# EAGLE board evcu_v_0-2 (EAGLE 6.5.0), part 1 of 2
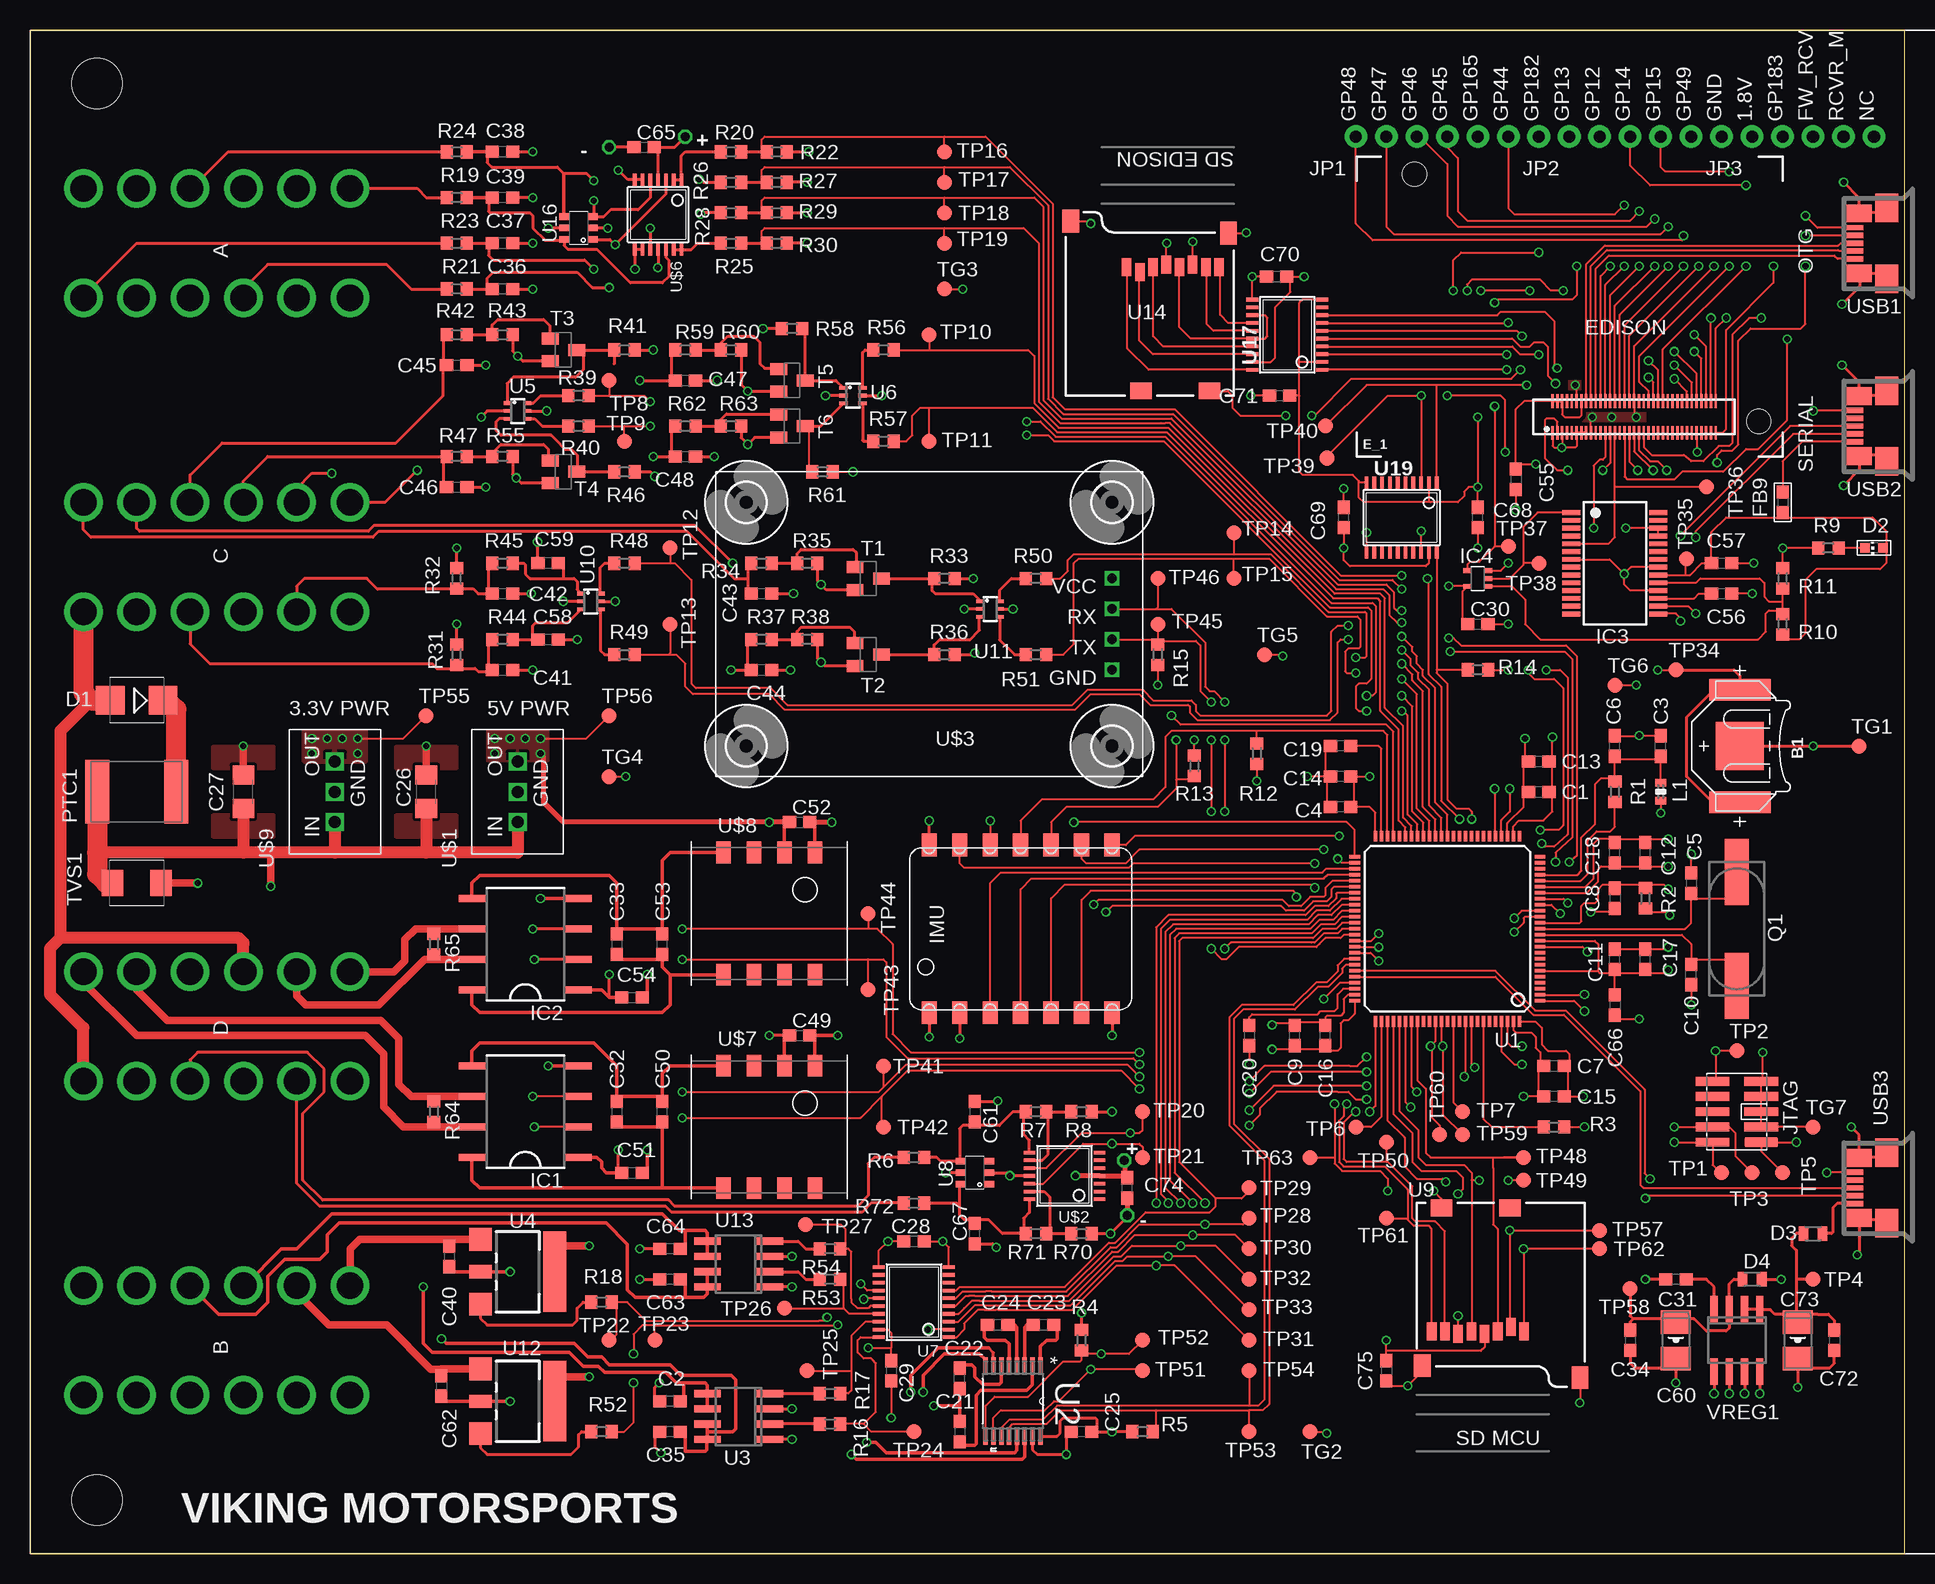
[diagram p9: board, top side]
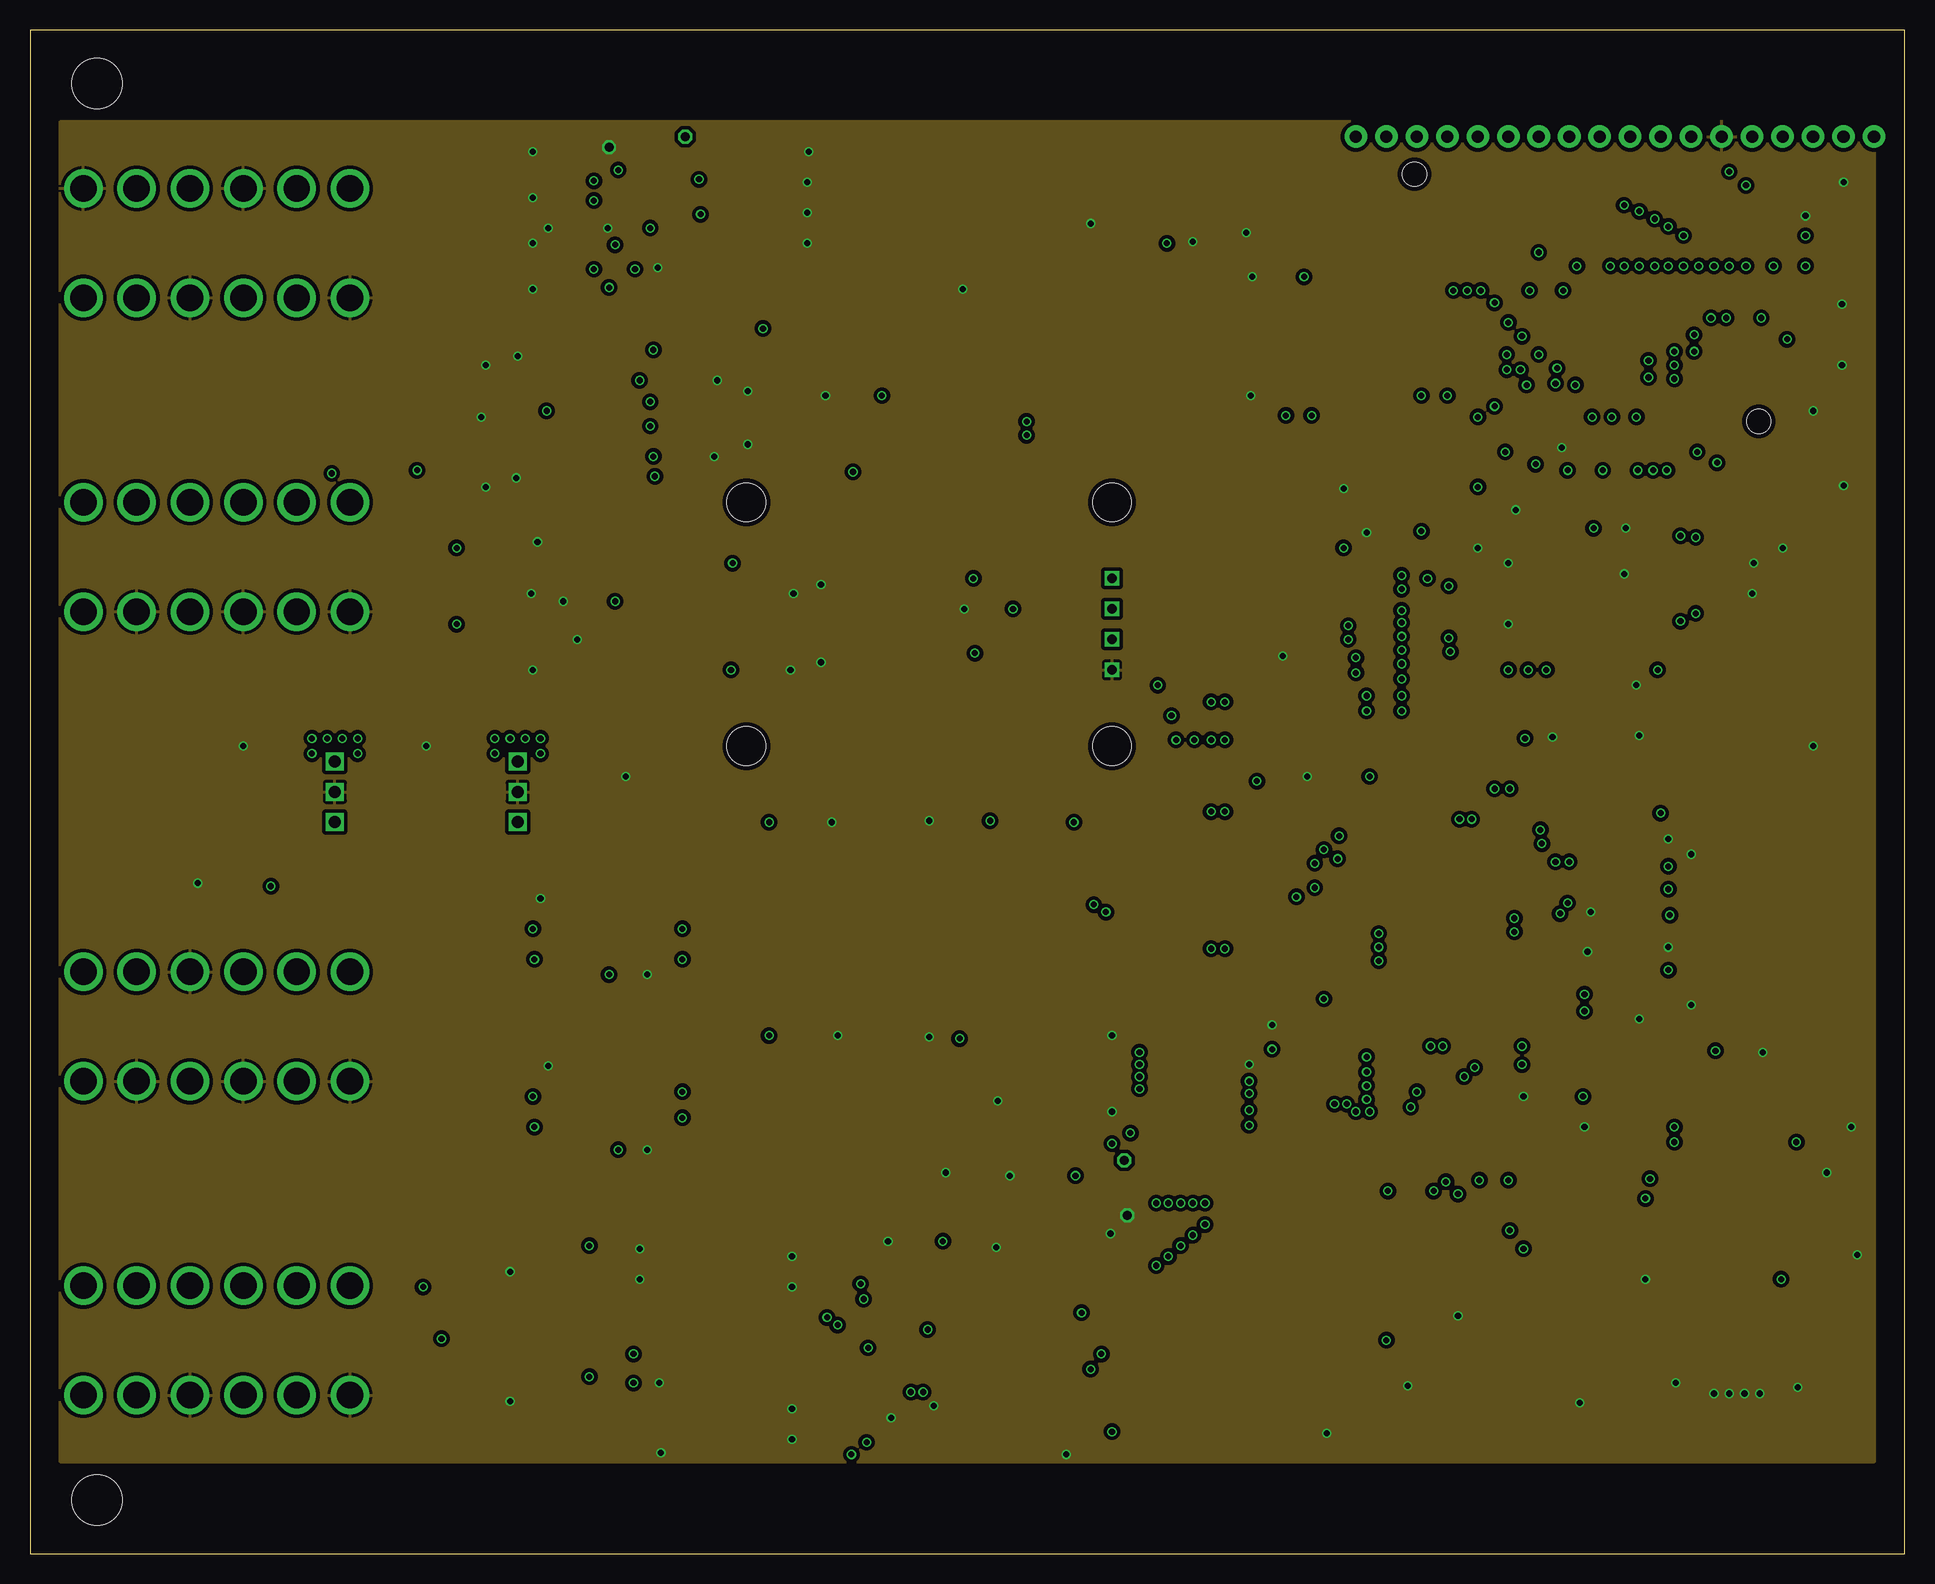
[diagram p10: board, inner layer Ground]
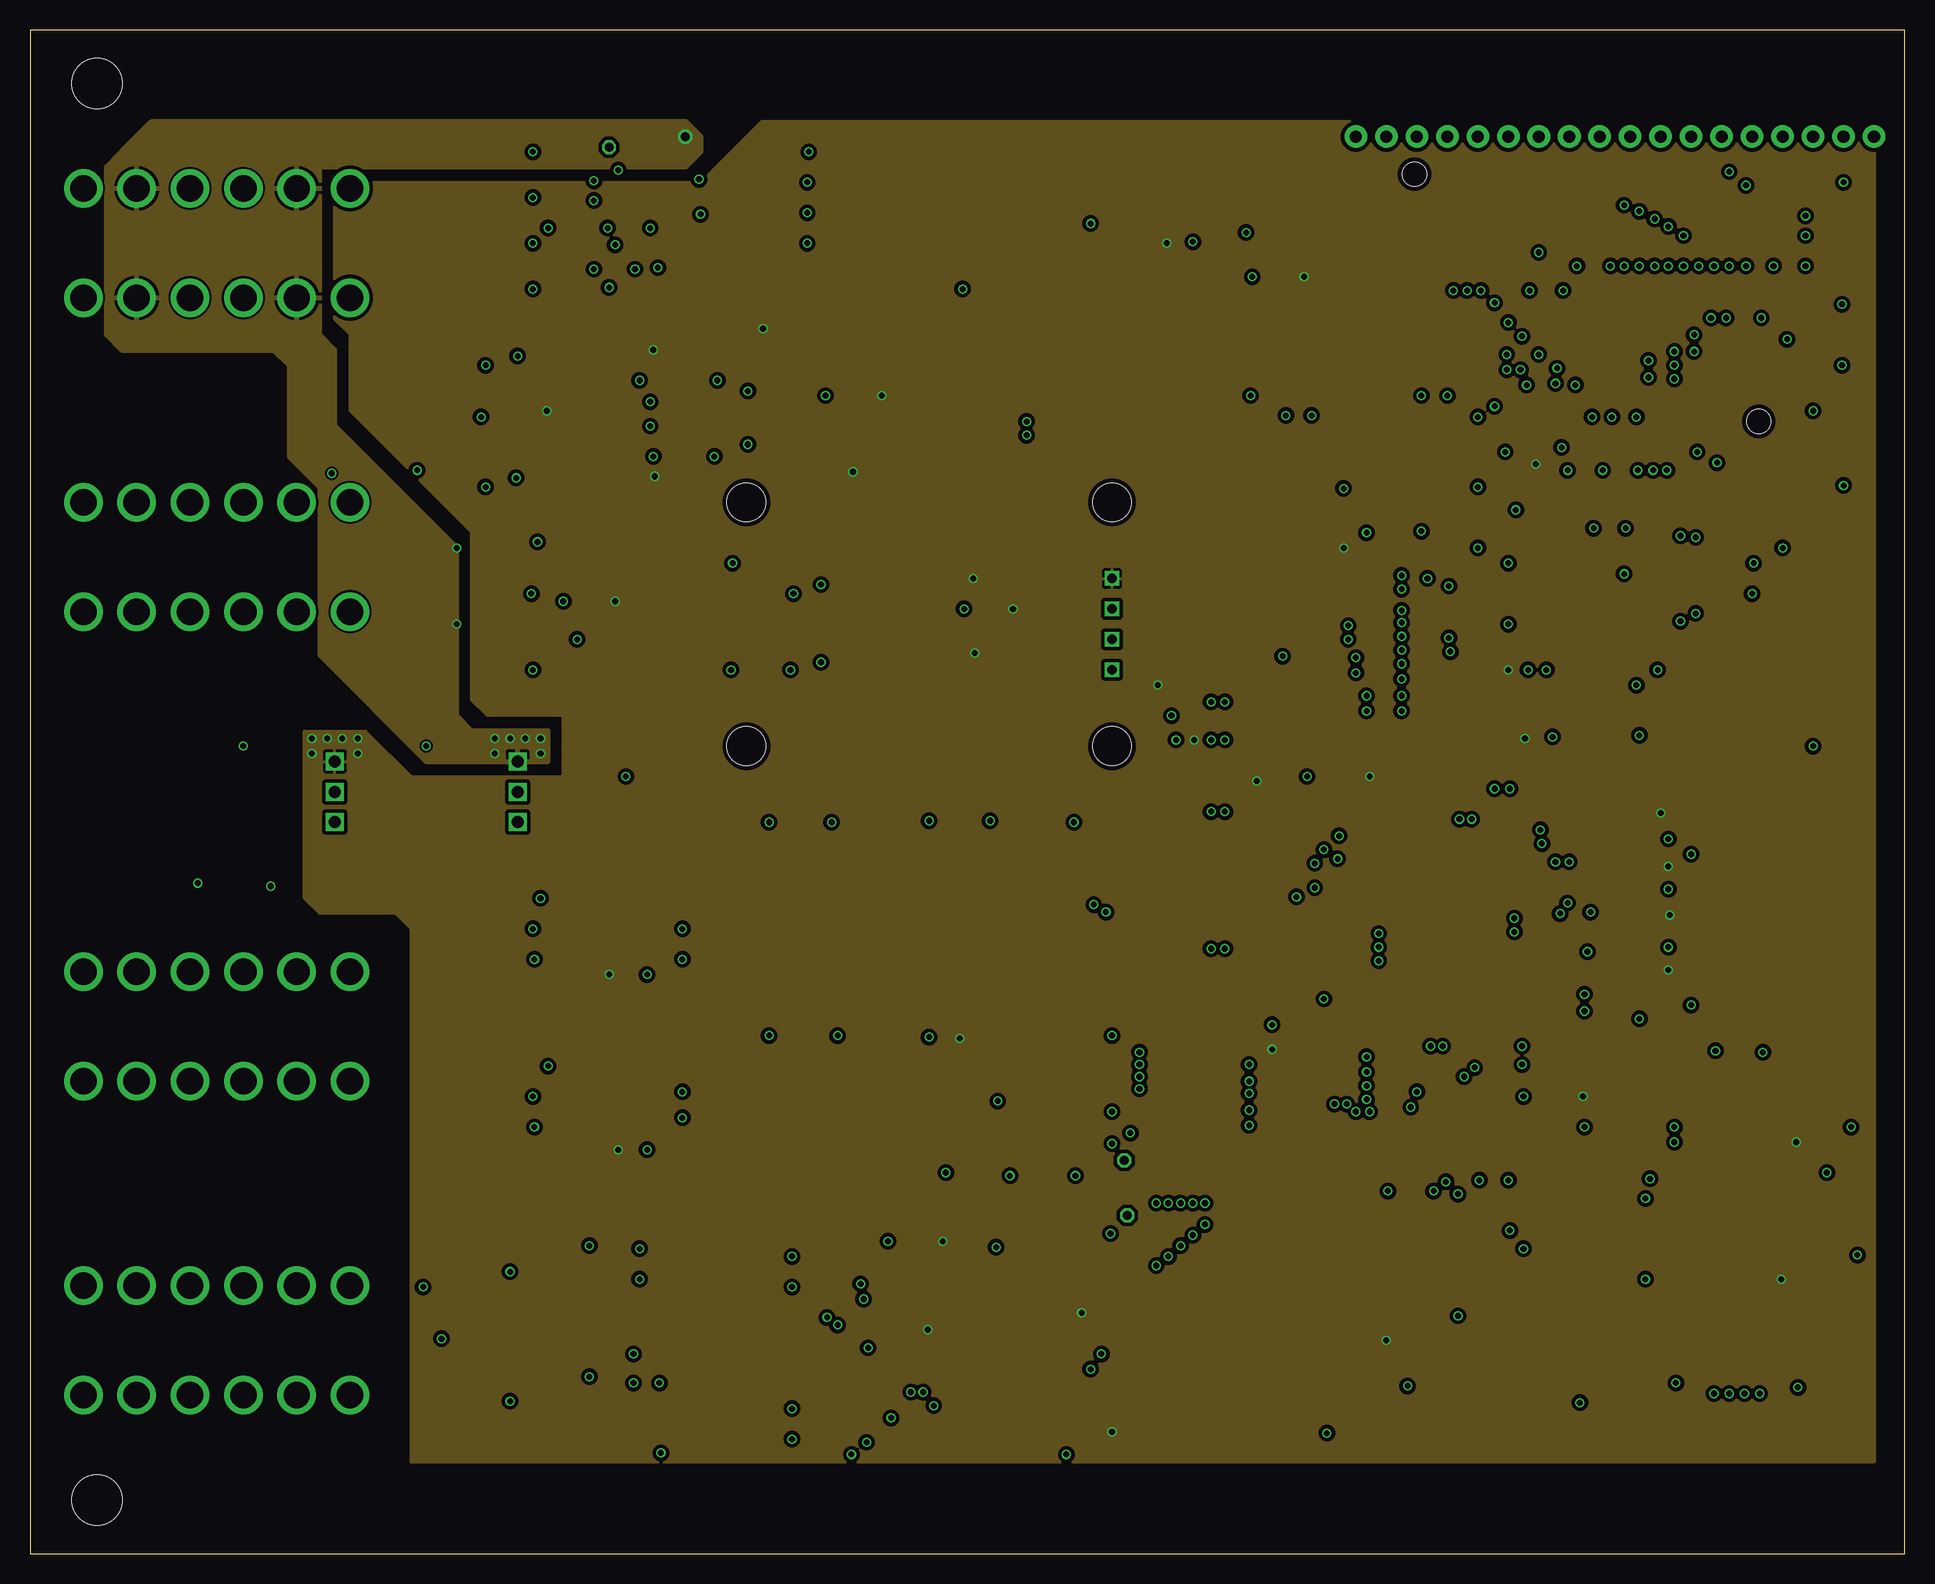
[diagram p11: board, inner layer Power]
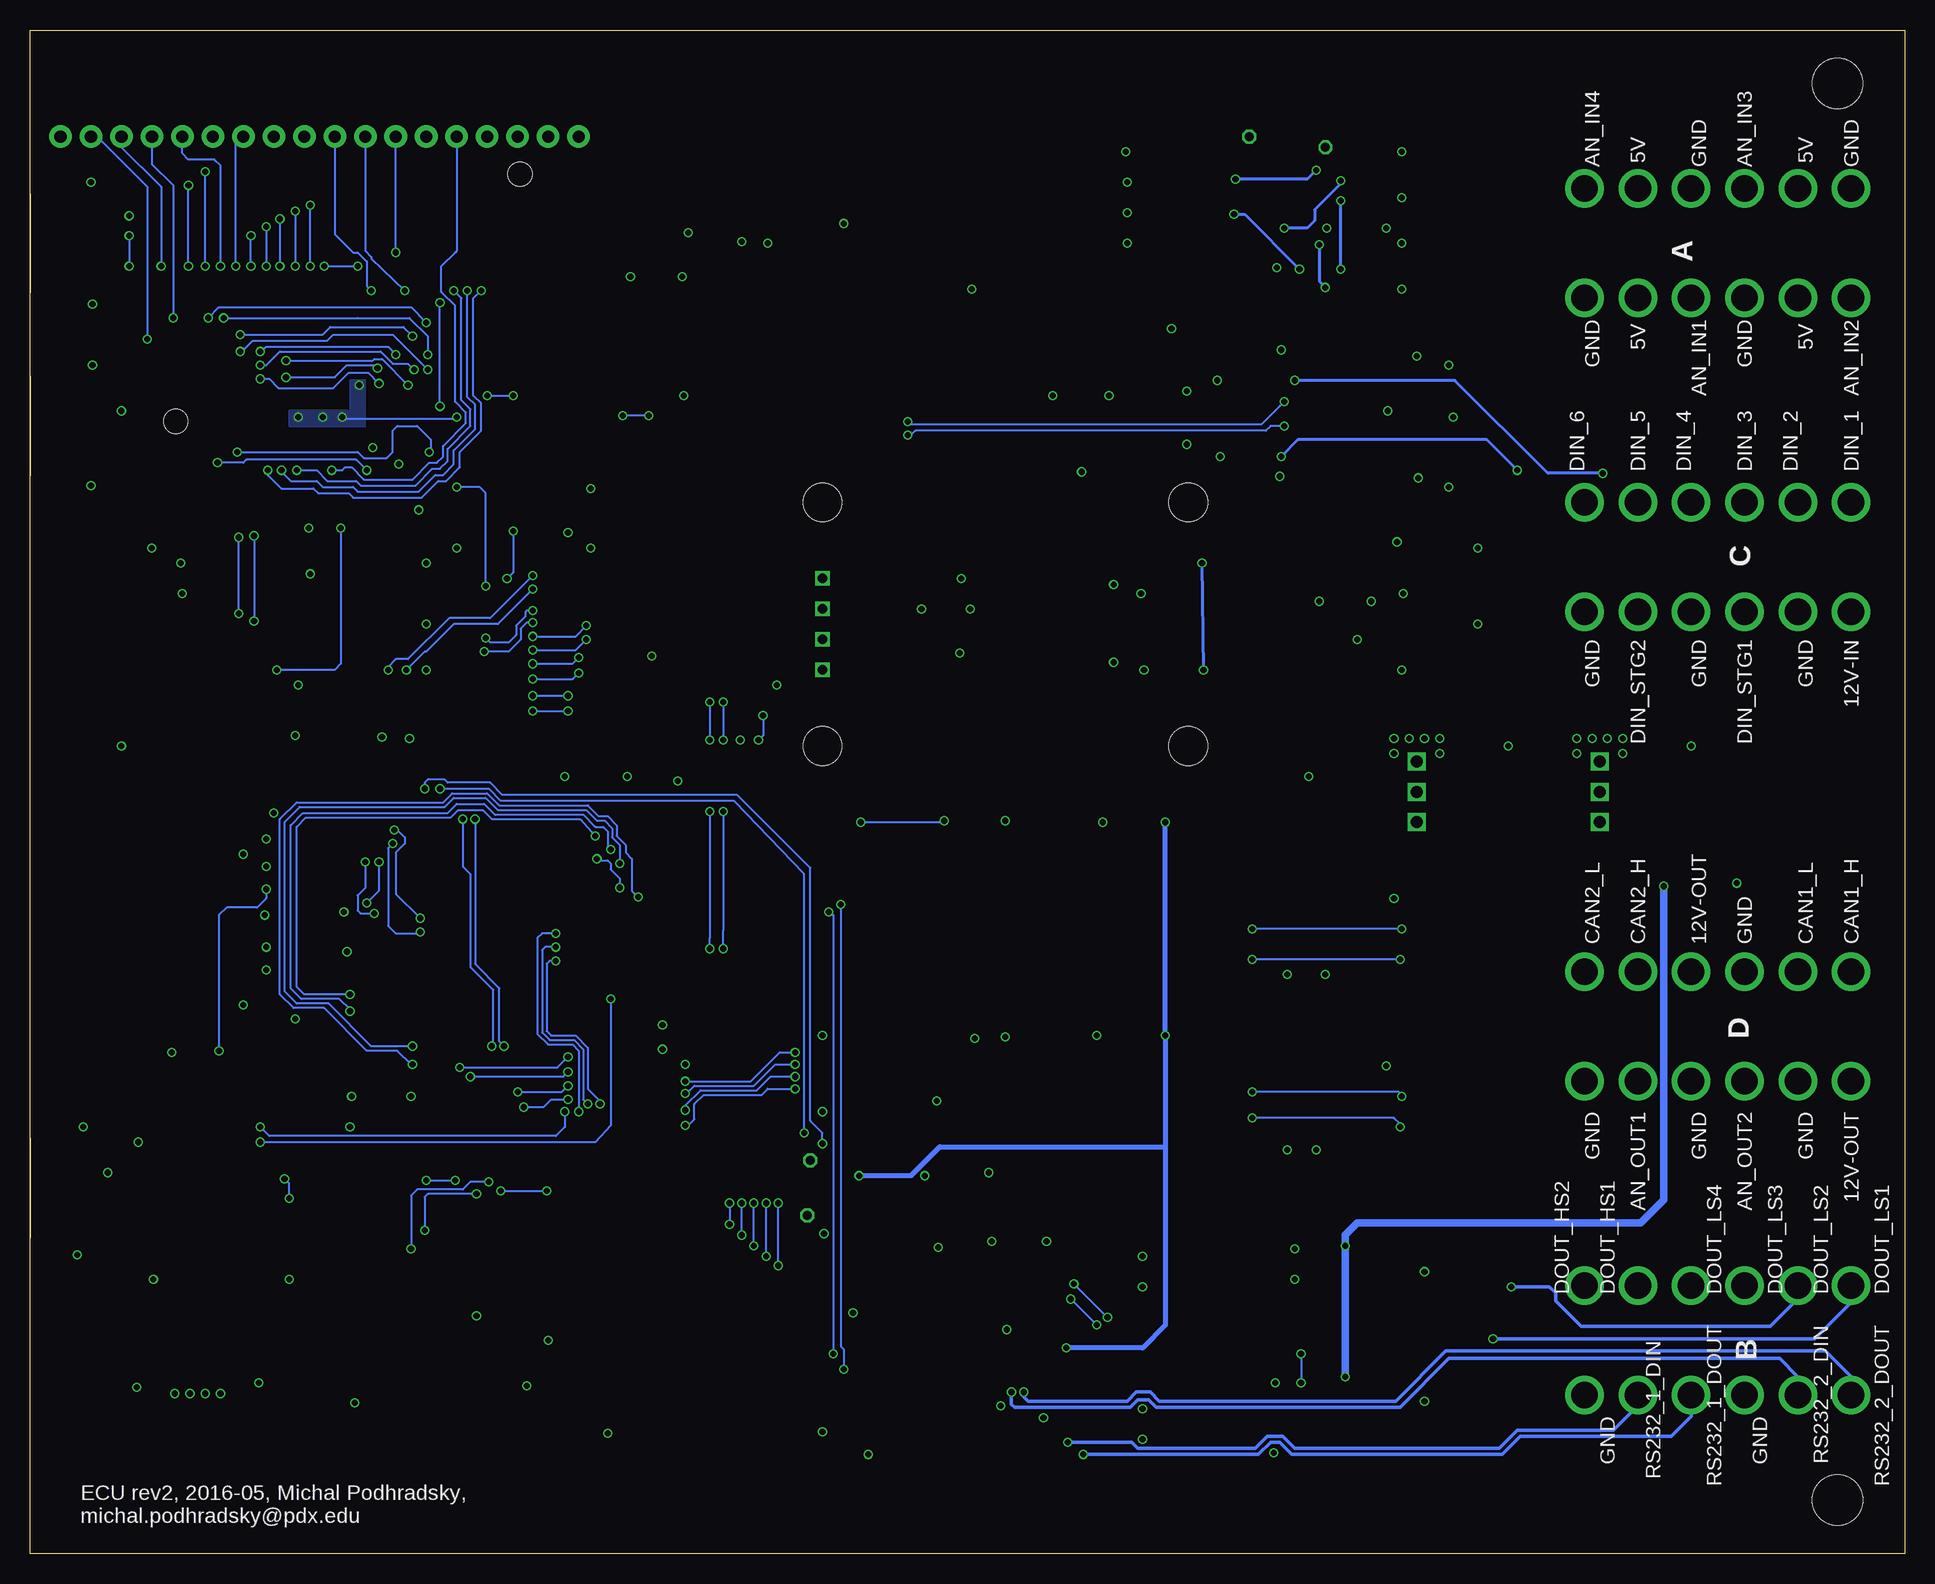
[diagram p12: board, bottom side, seen from below]

Size 156.21 x 127 mm. Coordinates in mm from the lower left corner, seen from the top.
Outline: 0,0 156.21,0 156.21,127 0,127 0,0
Copper layers (1*2*15*16): Top 0.035559375mm / dielectric 0.17018125mm / Ground 0.01778125mm / dielectric 47mil / Power 0.01778125mm / dielectric 0.17018125mm / Bottom 0.035559375mm
Design rules "OSHPark-4layer_edited *": minimum track width 7mil, minimum drill 20mil, track to track 7mil, track to pad 7mil, pad to pad 7mil, via to via 7mil, smd to smd 5mil, copper to edge 15mil, drill to drill 6mil, minimum pad ring 4mil, minimum via ring 4mil, stop-mask expansion 4mil, vias tented up to drill 20mil, thermal gap 10mil
Net classes: 0 default: width 0.178 mm, drill 0.508 mm, clearance 0.178 mm

## Footprints (pad centres in the part's own frame; a part is rotated, then mirrored left to right if it is on the bottom)
BATTERY_6.8MM-2998 = smd 1.8 x 5.1: +1 4.7,0; +2 -4.7,0 | smd 4 x 4: - 0,0
C0603@1 = smd 1.1 x 1: 1 -0.85,0; 2 0.85,0
C1206 = smd 1.6 x 1.8: 1 -1.4,0; 2 1.4,0
C0603 = smd 1.1 x 1: 1 -0.85,0; 2 0.85,0
3528/B = smd 1.95 x 2.5: + -1.525,0; - 1.525,0
SMB = smd 2.4 x 2.4: A 2.2,0; C -2.2,0
D0603 = smd 0.8 x 0.8: A -0.75,0; C 0.75,0
MICROMELF-R = smd 0.8 x 1.2: A 0.8,0; C -0.8,0
EDISON_DAUGHTER = smd 1.14 x 0.2: 1 1.98,19.17; 2 4.62,19.17; 3 1.98,18.77; 4 4.62,18.77; 5 1.98,18.37; 6 4.62,18.37; 7 1.98,17.97; 8 4.62,17.97; 9 1.98,17.57; 10 4.62,17.57; 11 1.98,17.17; 12 4.62,17.17; 13 1.98,16.77; 14 4.62,16.77; 15 1.98,16.37; 16 4.62,16.37; 17 1.98,15.97; 18 4.62,15.97; 19 1.98,15.57; 20 4.62,15.57; 21 1.98,15.17; 22 4.62,15.17; 23 1.98,14.77; 24 4.62,14.77; 25 1.98,14.37; 26 4.62,14.37; 27 1.98,13.97; 28 4.62,13.97; 29 1.98,13.57; 30 4.62,13.57; 31 1.98,13.17; 32 4.62,13.17; 33 1.98,12.77; 34 4.62,12.77; 35 1.98,12.37; 36 4.62,12.37; 37 1.98,11.97; 38 4.62,11.97; 39 1.98,11.57; 40 4.62,11.57; 41 1.98,11.17; 42 4.62,11.17; 43 1.98,10.77; 44 4.62,10.77; 45 1.98,10.37; 46 4.62,10.37; 47 1.98,9.97; 48 4.62,9.97; 49 1.98,9.57; 50 4.62,9.57; 51 1.98,9.17; 52 4.62,9.17; 53 1.98,8.77; 54 4.62,8.77; 55 1.98,8.37; 56 4.62,8.37; 57 1.98,7.97; 58 4.62,7.97; 59 1.98,7.57; 60 4.62,7.57; 61 1.98,7.17; 62 4.62,7.17; 63 1.98,6.77; 64 4.62,6.77; 65 1.98,6.37; 66 4.62,6.37; 67 1.98,5.97; 68 4.62,5.97; 69 1.98,5.57; 70 4.62,5.57 | hole 2: 23.53,30.67; 2.93,1.98
DUB-R-PDSO-G8 = smd 0.6 x 2.2: 1 -3.81,-4.445; 2 -1.27,-4.445; 3 1.27,-4.445; 4 3.81,-4.445; 5 3.81,4.445; 6 1.27,4.445; 7 -1.27,4.445; 8 -3.81,4.445
SSOP28 = smd 0.4 x 1.5: 1 -4.225,-3.625; 2 -3.575,-3.625; 3 -2.925,-3.625; 4 -2.275,-3.625; 5 -1.625,-3.625; 6 -0.975,-3.625; 7 -0.325,-3.625; 8 0.325,-3.625; 9 0.975,-3.625; 10 1.625,-3.625; 11 2.275,-3.625; 12 2.925,-3.625; 13 3.575,-3.625; 14 4.225,-3.625; 15 4.225,3.625; 16 3.575,3.625; 17 2.925,3.625; 18 2.275,3.625; 19 1.625,3.625; 20 0.975,3.625; 21 0.325,3.625; 22 -0.325,3.625; 23 -0.975,3.625; 24 -1.625,3.625; 25 -2.275,3.625; 26 -2.925,3.625; 27 -3.575,3.625; 28 -4.225,3.625
SC70-5 = smd 0.4 x 0.7: 1 -0.65,-0.85; 2 0,-0.85; 3 0.65,-0.85; 4 0.65,0.85; 5 -0.65,0.85
ASPIRIN_1 = smd 1.905 x 1.27: P$1 -6.985,7.62; P$2 -6.985,5.08; P$3 -6.985,2.54; P$4 -6.985,0; P$5 -6.985,-2.54; P$6 -6.985,-5.08; P$7 -6.985,-7.62; P$8 6.985,-7.62; P$9 6.985,-5.08; P$10 6.985,-2.54; P$11 6.985,0; P$12 6.985,2.54; P$13 6.985,5.08; P$14 6.985,7.62
1X06 = drill 1.016 pad 1.88: 1 0,0; 2 2.54,0; 3 5.08,0; 4 7.62,0; 5 10.16,0; 6 12.7,0
FTSH-105-DV = smd 0.74 x 2.8: 1 -2.54,-2.03; 2 -2.54,2.03; 3 -1.27,-2.03; 4 -1.27,2.03; 5 0,-2.03; 6 0,2.03; 7 1.27,-2.03; 8 1.27,2.03; 9 2.54,-2.03; 10 2.54,2.03
0603-IND = smd 0.6 x 0.9: P$1 -0.75,0; P$2 0.75,0
2920L = smd 2 x 5.3: P$1 3.3,0; P$2 -3.3,0
CSM-7X-DU = smd 5.5 x 2: 1 -4.75,0; 2 4.75,0
R0603 = smd 1 x 1.1: 1 -0.85,0; 2 0.85,0
SOT23-BEC = smd 1 x 1.4: B -0.95,-1.1; C 0,1.1; E 0.95,-1.1
B1,27 = smd 1.27 x 1.27: TP 0,0
SMBJ = smd 1.78 x 2.16: A 2.04,0; C -2.03,0
LQFP100 = smd 0.9 x 0.3: 1 -7.72,6; 2 -7.72,5.5; 3 -7.72,5; 4 -7.72,4.5; 5 -7.72,4; 6 -7.72,3.5; 7 -7.72,3; 8 -7.72,2.5; 9 -7.72,2; 10 -7.72,1.5; 11 -7.72,1; 12 -7.72,0.5; 13 -7.72,0; 14 -7.72,-0.5; 15 -7.72,-1; 16 -7.72,-1.5; 17 -7.72,-2; 18 -7.72,-2.5; 19 -7.72,-3; 20 -7.72,-3.5; 21 -7.72,-4; 22 -7.72,-4.5; 23 -7.72,-5; 24 -7.72,-5.5; 25 -7.72,-6; 51 7.72,-6; 52 7.72,-5.5; 53 7.72,-5; 54 7.72,-4.5; 55 7.72,-4; 56 7.72,-3.5; 57 7.72,-3; 58 7.72,-2.5; 59 7.72,-2; 60 7.72,-1.5; 61 7.72,-1; 62 7.72,-0.5; 63 7.72,0; 64 7.72,0.5; 65 7.72,1; 66 7.72,1.5; 67 7.72,2; 68 7.72,2.5; 69 7.72,3; 70 7.72,3.5; 71 7.72,4; 72 7.72,4.5; 73 7.72,5; 74 7.72,5.5; 75 7.72,6 | smd 0.3 x 0.9: 26 -6,-7.72; 27 -5.5,-7.72; 28 -5,-7.72; 29 -4.5,-7.72; 30 -4,-7.72; 31 -3.5,-7.72; 32 -3,-7.72; 33 -2.5,-7.72; 34 -2,-7.72; 35 -1.5,-7.72; 36 -1,-7.72; 37 -0.5,-7.72; 38 0,-7.72; 39 0.5,-7.72; 40 1,-7.72; 41 1.5,-7.72; 42 2,-7.72; 43 2.5,-7.72; 44 3,-7.72; 45 3.5,-7.72; 46 4,-7.72; 47 4.5,-7.72; 48 5,-7.72; 49 5.5,-7.72; 50 6,-7.72; 76 6,7.72; 77 5.5,7.72; 78 5,7.72; 79 4.5,7.72; 80 4,7.72; 81 3.5,7.72; 82 3,7.72; 83 2.5,7.72; 84 2,7.72; 85 1.5,7.72; 86 1,7.72; 87 0.5,7.72; 88 0,7.72; 89 -0.5,7.72; 90 -1,7.72; 91 -1.5,7.72; 92 -2,7.72; 93 -2.5,7.72; 94 -3,7.72; 95 -3.5,7.72; 96 -4,7.72; 97 -4.5,7.72; 98 -5,7.72; 99 -5.5,7.72; 100 -6,7.72
SOP65P640X120-16N = smd 1.473 x 0.356: 1 -2.921,2.286; 2 -2.921,1.626; 3 -2.921,0.965; 4 -2.921,0.33; 5 -2.921,-0.33; 6 -2.921,-0.965; 7 -2.921,-1.626; 8 -2.921,-2.286; 9 2.921,-2.286; 10 2.921,-1.626; 11 2.921,-0.965; 12 2.921,-0.33; 13 2.921,0.33; 14 2.921,0.965; 15 2.921,1.626; 16 2.921,2.286
SOIC8 = smd 0.6 x 2.2: 1 -1.905,-2.6; 2 -0.635,-2.6; 3 0.635,-2.6; 4 1.905,-2.6; 5 1.905,2.6; 6 0.635,2.6; 7 -0.635,2.6; 8 -1.905,2.6
SOT223-W = smd 1.9 x 1.9: 1 -2.7,-3.1; 3 2.7,-3.1 | smd 1.1 x 1.9: 2 0,-3.1 | smd 6.7 x 1.9: 4 0,3.1
SOT363_INFINEON = smd 0.3 x 0.7: 1 -0.65,-0.8; 2 0,-0.8; 3 0.65,-0.8; 4 0.65,0.8; 5 0,0.8; 6 -0.65,0.8
TSSOP20 = smd 0.305 x 0.991: 1 -2.925,-2.918; 2 -2.275,-2.918; 3 -1.625,-2.918; 4 -0.975,-2.918; 5 -0.325,-2.918; 6 0.325,-2.918; 7 0.975,-2.918; 8 1.625,-2.918; 9 2.275,-2.918; 10 2.925,-2.918; 11 2.925,2.918; 12 2.275,2.918; 13 1.625,2.918; 14 0.975,2.918; 15 0.325,2.918; 16 -0.325,2.918; 17 -0.975,2.918; 18 -1.625,2.918; 19 -2.275,2.918; 20 -2.925,2.918
SOT457R_PHILIPS = smd 0.55 x 0.8: 1 -0.95,-1.2; 2 0,-1.2; 3 0.95,-1.2; 4 0.95,1.2; 5 0,1.2; 6 -0.95,1.2
MICRO-SD-SOCKET-PP = smd 0.8 x 1.5: 1 -8.94,10.7; 2 -7.84,10.3; 3 -6.74,10.7; 4 -5.64,10.9; 5 -4.54,10.7; 6 -3.44,10.9; 7 -2.34,10.7; 8 -1.24,10.7 | smd 1.8 x 1.4: CD1 -2.05,0.4; CD2 -7.75,0.4 | smd 1.4 x 1.9: GND1 -13.6,14.55; GND3 -0.45,13.55
OKI-78SR = drill 1 square: P1 -2.54,0; P2 0,0; P3 2.54,0
TSSOP14 = smd 0.305 x 0.991: 1 -2.22,-2.763; 2 -1.57,-2.763; 3 -0.92,-2.763; 4 -0.27,-2.763; 5 0.38,-2.763; 6 1.03,-2.763; 7 1.68,-2.763; 8 1.68,3.073; 9 1.03,3.073; 10 0.38,3.073; 11 -0.27,3.073; 12 -0.92,3.073; 13 -1.57,3.073; 14 -2.22,3.073
GPS_UBLOX = drill 0.8 square: GND -15.24,3.81; RX -15.24,-1.27; TX -15.24,1.27; VCC -15.24,-3.81 | hole 3.2: -15.24,10.16; 15.24,10.16; -15.24,-10.16; 15.24,-10.16
DEUTSCH_48_PIN = drill 2.2: A$1 -41.173,26.67; A$2 -41.173,22.225; A$3 -41.173,17.78; A$4 -41.173,13.335; A$5 -41.173,8.89; A$6 -41.173,4.445; A$7 -50.292,4.445; A$8 -50.292,8.89; A$9 -50.292,13.335; A$10 -50.292,17.78; A$11 -50.292,22.225; A$12 -50.292,26.67; B$1 -15.011,26.67; B$2 -15.011,22.225; B$3 -15.011,17.78; B$4 -15.011,13.335; B$5 -15.011,8.89; B$6 -15.011,4.445; B$7 -24.13,4.445; B$8 -24.13,8.89; B$9 -24.13,13.335; B$10 -24.13,17.78; B$11 -24.13,22.225; B$12 -24.13,26.67; C$1 24.13,26.67; C$2 24.13,22.225; C$3 24.13,17.78; C$4 24.13,13.335; C$5 24.13,8.89; C$6 24.13,4.445; C$7 15.011,4.445; C$8 15.011,8.89; C$9 15.011,13.335; C$10 15.011,17.78; C$11 15.011,22.225; C$12 15.011,26.67; D$1 50.292,26.67; D$2 50.292,22.225; D$3 50.292,17.78; D$4 50.292,13.335; D$5 50.292,8.89; D$6 50.292,4.445; D$7 41.173,4.445; D$8 41.173,8.89; D$9 41.173,13.335; D$10 41.173,17.78; D$11 41.173,22.225; D$12 41.173,26.67 | hole 4.191: -59.055,5.588; 59.055,5.588
R1SE = smd 1.2 x 1.8: P1 -3.81,-5.1; P2 -1.27,-5.1; P3 1.27,-5.1; P4 3.81,-5.1; P5 3.81,5.1; P6 1.27,5.1; P7 -1.27,5.1; P8 -3.81,5.1
MOLEX-47364-0001 = smd 1.7 x 0.45: 1 2.8,1.3; 2 2.8,0.65; 3 2.8,0; 4 2.8,-0.65; 5 2.8,-1.3 | smd 1.9 x 2.375: GND1 0,2.95; GND4 0,-2.95 | smd 2.1 x 1.475: GND2 2.3,2.5; GND3 2.3,-2.5

## Placement (x,y rotation side)
B1  36-2998-ND  [BATTERY_6.8MM-2998]  142.49,67.31 270 top
C1  1u  [C0603@1]  125.73,63.5 0 top
C2  0.1u  [C0603@1]  53.34,12.7 180 top
C3  1u  [C0603@1]  135.89,67.31 90 top
C4  1u  [C0603@1]  109.22,62.23 180 top
C5  30p  [C0603@1]  138.43,55.88 270 top
C6  0.1u  [C0603@1]  132.08,67.31 90 top
C7  1u  [C0603@1]  127,40.64 180 top
C8  0.1u  [C0603@1]  132.08,54.61 270 top
C9  1u  [C0603@1]  105.41,43.18 90 top
C10  30p  [C0603@1]  138.43,48.26 90 top
C11  1u  [C0603@1]  132.08,49.53 90 top
C12  1u  [C0603@1]  134.62,58.42 90 top
C13  0.1u  [C0603@1]  125.73,66.04 0 top
C14  0.1u  [C0603@1]  109.22,64.77 180 top
C15  0.1u  [C0603@1]  127,38.1 180 top
C16  0.1u  [C0603@1]  107.95,43.18 90 top
C17  0.1u  [C0603@1]  134.62,49.53 90 top
C18  0.1u  [C0603@1]  132.08,58.42 90 top
C19  2.2u  [C0603@1]  109.22,67.31 180 top
C20  2.2u  [C0603@1]  101.6,43.18 270 top
C21  0.1u  [C0603@1]  77.47,10.16 270 top
C22  0.1u  [C0603@1]  77.47,14.61 90 top
C23  0.1u  [C0603@1]  84.45,19.05 180 top
C24  0.1u  [C0603@1]  80.64,19.05 180 top
C25  0.1u  [C0603@1]  87.63,10.16 180 top
C26  22u  [C1206]  33.02,63.5 90 top
C27  22u  [C1206]  17.78,63.5 90 top
C28  0.1u  [C0603@1]  73.66,26.04 0 top
C29  0.1u  [C0603@1]  71.75,15.24 270 top
C30  0.1u  [C0603@1]  120.65,77.47 0 top
C31  470p  [C0603]  137.16,22.86 180 top
C32  0.1u  [C0603@1]  48.9,36.83 270 top
C33  0.1u  [C0603@1]  48.9,50.8 270 top
C34  100n  [C0603]  133.35,17.78 270 top
C35  0.1u  [C0603@1]  53.34,10.16 180 top
C36  0.1u  [C0603@1]  39.37,105.41 180 top
C37  0.1u  [C0603@1]  39.37,109.22 180 top
C38  0.1u  [C0603@1]  39.37,116.84 180 top
C39  0.1u  [C0603@1]  39.37,113.03 180 top
C40  0.1u  [C0603@1]  34.92,24.77 270 top
C41  1000p  [C0603@1]  39.37,73.66 0 top
C42  1000p  [C0603@1]  39.37,80.01 0 top
C43  1000p  [C0603@1]  60.96,80.01 0 top
C44  1000p  [C0603@1]  60.96,73.66 0 top
C45  1000p  [C0603@1]  35.56,99.06 0 top
C46  1000p  [C0603@1]  35.56,88.9 0 top
C47  1000p  [C0603@1]  54.61,97.79 0 top
C48  1000p  [C0603@1]  54.61,91.44 0 top
C49  0.1u  [C0603@1]  64.14,43.18 0 top
C50  10u, 25V, X5R  [C0603@1]  52.7,36.83 90 top
C51  0.1u  [C0603@1]  50.16,31.75 0 top
C52  0.1u  [C0603@1]  64.14,60.96 0 top
C53  10u, 25V, X5R  [C0603@1]  52.7,50.8 90 top
C54  0.1u  [C0603@1]  50.16,46.35 0 top
C55  0.1u  [C0603@1]  123.83,89.53 270 top
C56  0.1u  [C0603@1]  140.97,80.01 0 top
C57  0.1u  [C0603@1]  140.97,82.55 0 top
C58  100p  [C0603@1]  43.18,76.2 0 top
C59  100p  [C0603@1]  43.18,82.55 180 top
C60  22u  [3528/B]  137.16,17.78 270 top
C61  0.1u  [C0603@1]  78.74,36.83 270 top
C62  0.1u  [C0603@1]  34.29,13.97 270 top
C63  0.1u  [C0603@1]  53.34,22.86 180 top
C64  0.1u  [C0603@1]  53.34,25.4 180 top
C65  0.1u  [C0603@1]  51.18,117.22 0 top
C66  0.1u  [C0603@1]  132.08,45.72 270 top
C67  0.1u  [C0603@1]  78.74,26.67 90 top
C68  0.1u  [C0603@1]  120.65,86.36 90 top
C69  0.1u  [C0603@1]  109.47,86.36 90 top
C70  0.1u  [C0603@1]  103.89,106.43 180 top
C71  0.1u  [C0603@1]  104.14,96.52 0 top
C72  100n  [C0603]  150.37,17.78 270 top
C73  22u  [3528/B]  147.32,17.78 270 top
C74  0.1u  [C0603@1]  91.44,30.48 90 top
C75  0.1u  [C0603@1]  113.03,15.24 270 top
D1  B360B-13-F  [SMB]  8.89,71.12 180 top
D2  GREEN  [D0603]  153.67,83.82 180 top
D3  1N5819  [MICROMELF-R]  148.59,26.67 0 top
D4  1N5819  [MICROMELF-R]  143.51,22.86 180 top
E_1  EDISON_CONNECTOR_SEGMENTED  [EDISON_DAUGHTER]  146.05,91.44 90 top
FB9  600R 1A  [C0603]  146.05,87.63 270 top
IC1  ISO1050DUB  [DUB-R-PDSO-G8]  41.27,36.83 90 top
IC2  ISO1050DUB  [DUB-R-PDSO-G8]  41.27,50.8 90 top
IC3  FT232RL  [SSOP28]  132.08,82.55 270 top
IC4  74AHC1G126DCK  [SC70-5]  120.65,81.28 90 top
IMU  ASPIRIN  [ASPIRIN_1]  82.55,52.07 90 top
JP1  [1X06]  110.49,118.11 0 top
JP2  [1X06]  125.73,118.11 0 top
JP3  [1X06]  140.97,118.11 0 top
JTAG  PIN_HDR_EDG_1.27MM_5-2  [FTSH-105-DV]  142.24,36.83 90 top
L1  600R  [0603-IND]  135.89,63.5 90 top
PTC1  2920L185DR  [2920L]  8.89,63.5 0 top
Q1  ABLS-25MHz  [CSM-7X-DU]  142.24,52.07 270 top
R1  47R  [R0603]  132.08,63.5 270 top
R2  10k  [R0603]  134.62,54.61 90 top
R3  10k  [R0603]  127,35.56 0 top
R4  10k  [R0603]  87.63,17.78 270 top
R5  10k  [R0603]  92.71,10.16 0 top
R6  470R  [R0603]  73.66,33.02 180 top
R7  1k1  [R0603]  83.82,36.83 180 top
R8  2k2  [R0603]  87.63,36.83 180 top
R9  330R  [R0603]  149.86,83.82 0 top
R10  4k7  [R0603]  146.05,77.47 270 top
R11  10k  [R0603]  146.05,81.28 270 top
R12  2k2  [R0603]  102.23,66.67 270 top
R13  2k2  [R0603]  97.03,65.66 90 top
R14  10k  [R0603]  120.65,73.66 180 top
R15  10k  [R0603]  93.98,74.93 90 top
R16  470R  [R0603]  66.67,10.79 180 top
R17  470R  [R0603]  66.67,13.34 180 top
R18  470R  [R0603]  47.62,20.95 180 top
R19  10k  [R0603]  35.56,113.03 0 top
R20  1k1  [R0603]  58.42,116.84 0 top
R21  10k  [R0603]  35.56,105.41 0 top
R22  2k2  [R0603]  62.23,116.84 180 top
R23  10k  [R0603]  35.56,109.22 0 top
R24  10k  [R0603]  35.56,116.84 0 top
R25  1k1  [R0603]  58.42,109.22 0 top
R26  1k1  [R0603]  58.42,114.3 0 top
R27  2k2  [R0603]  62.23,114.3 180 top
R28  1k1  [R0603]  58.42,111.76 0 top
R29  2k2  [R0603]  62.23,111.76 180 top
R30  2k2  [R0603]  62.23,109.22 180 top
R31  2k43  [R0603]  35.56,74.93 270 top
R32  2k43  [R0603]  35.56,81.28 90 top
R33  10k  [R0603]  76.2,81.28 0 top
R34  10k  [R0603]  60.96,82.55 0 top
R35  4k7  [R0603]  64.77,82.55 180 top
R36  10k  [R0603]  76.2,74.93 0 top
R37  10k  [R0603]  60.96,76.2 0 top
R38  4k7  [R0603]  64.77,76.2 180 top
R39  1k  [R0603]  45.72,96.52 0 top
R40  1k  [R0603]  45.72,93.98 0 top
R41  10k  [R0603]  49.53,100.33 0 top
R42  10k  [R0603]  35.56,101.6 0 top
R43  4k7  [R0603]  39.37,101.6 180 top
R44  41k2  [R0603]  39.37,76.2 0 top
R45  41k2  [R0603]  39.37,82.55 0 top
R46  10k  [R0603]  49.53,90.17 0 top
R47  10k  [R0603]  35.56,91.44 0 top
R48  1k  [R0603]  49.53,82.55 0 top
R49  1k  [R0603]  49.53,74.93 0 top
R50  1k  [R0603]  83.82,81.28 0 top
R51  1k  [R0603]  83.82,74.93 0 top
R52  470R  [R0603]  47.62,10.16 180 top
R53  470R  [R0603]  66.67,22.86 180 top
R54  470R  [R0603]  66.67,25.4 180 top
R55  4k7  [R0603]  39.37,91.44 180 top
R56  1k  [R0603]  71.12,100.33 0 top
R57  1k  [R0603]  71.12,92.71 0 top
R58  10k  [R0603]  63.5,102.11 180 top
R59  10k  [R0603]  54.61,100.33 0 top
R60  4k7  [R0603]  58.42,100.33 180 top
R61  10k  [R0603]  66.04,90.17 0 top
R62  10k  [R0603]  54.61,93.98 0 top
R63  4k7  [R0603]  58.42,93.98 180 top
R64  120R, 1%  [R0603]  33.66,36.83 270 top
R65  120R, 1%  [R0603]  33.66,50.8 270 top
R70  2k2  [R0603]  87.63,26.67 180 top
R71  1k1  [R0603]  83.82,26.67 180 top
R72  470R  [R0603]  73.66,29.21 180 top
T1  DK:MMBT3904LT1GOSCT-ND  [SOT23-BEC]  69.85,81.28 270 top
T2  DK:MMBT3904LT1GOSCT-ND  [SOT23-BEC]  69.85,74.93 270 top
T3  DK:MMBT3904LT1GOSCT-ND  [SOT23-BEC]  44.45,100.33 270 top
T4  DK:MMBT3904LT1GOSCT-ND  [SOT23-BEC]  44.45,90.17 270 top
T5  DK:MMBT3904LT1GOSCT-ND  [SOT23-BEC]  63.5,97.79 270 top
T6  DK:MMBT3904LT1GOSCT-ND  [SOT23-BEC]  63.5,93.98 270 top
TG1  TPB1,27  [B1,27]  152.4,67.31 0 top
TG2  TPB1,27  [B1,27]  106.68,10.16 0 top
TG3  TPB1,27  [B1,27]  76.2,105.41 0 top
TG4  TPB1,27  [B1,27]  48.26,64.77 0 top
TG5  TPB1,27  [B1,27]  102.87,74.93 0 top
TG6  TPB1,27  [B1,27]  132.08,72.39 0 top
TG7  TPB1,27  [B1,27]  148.59,35.56 0 top
TP1  TPB1,27  [B1,27]  140.97,31.75 0 top
TP2  TPB1,27  [B1,27]  142.24,41.91 0 top
TP3  TPB1,27  [B1,27]  143.51,31.75 0 top
TP4  TPB1,27  [B1,27]  148.59,22.86 0 top
TP5  TPB1,27  [B1,27]  146.05,31.75 0 top
TP6  TPB1,27  [B1,27]  110.49,35.56 0 top
TP7  TPB1,27  [B1,27]  119.38,36.83 0 top
TP8  TPB1,27  [B1,27]  48.26,97.79 0 top
TP9  TPB1,27  [B1,27]  49.53,92.71 0 top
TP10  TPB1,27  [B1,27]  74.93,101.6 0 top
TP11  TPB1,27  [B1,27]  74.93,92.71 0 top
TP12  TPB1,27  [B1,27]  53.34,83.82 0 top
TP13  TPB1,27  [B1,27]  53.34,77.47 0 top
TP14  TPB1,27  [B1,27]  100.33,85.09 0 top
TP15  TPB1,27  [B1,27]  100.33,81.28 0 top
TP16  TPB1,27  [B1,27]  76.2,116.84 0 top
TP17  TPB1,27  [B1,27]  76.2,114.3 0 top
TP18  TPB1,27  [B1,27]  76.2,111.76 0 top
TP19  TPB1,27  [B1,27]  76.2,109.22 0 top
TP20  TPB1,27  [B1,27]  92.71,36.83 0 top
TP21  TPB1,27  [B1,27]  92.71,33.02 0 top
TP22  TPB1,27  [B1,27]  48.26,17.78 0 top
TP23  TPB1,27  [B1,27]  52.07,17.78 0 top
TP24  TPB1,27  [B1,27]  73.66,10.16 0 top
TP25  TPB1,27  [B1,27]  64.77,15.24 0 top
TP26  TPB1,27  [B1,27]  62.87,20.45 0 top
TP27  TPB1,27  [B1,27]  64.64,27.43 0 top
TP28  TPB1,27  [B1,27]  101.6,27.94 0 top
TP29  TPB1,27  [B1,27]  101.6,30.48 0 top
TP30  TPB1,27  [B1,27]  101.6,25.4 0 top
TP31  TPB1,27  [B1,27]  101.6,17.78 0 top
TP32  TPB1,27  [B1,27]  101.6,22.86 0 top
TP33  TPB1,27  [B1,27]  101.6,20.32 0 top
TP34  TPB1,27  [B1,27]  137.16,73.66 0 top
TP35  TPB1,27  [B1,27]  138.05,82.93 0 top
TP36  TPB1,27  [B1,27]  139.7,88.9 0 top
TP37  TPB1,27  [B1,27]  123.19,83.95 0 top
TP38  TPB1,27  [B1,27]  125.73,82.55 0 top
TP39  TPB1,27  [B1,27]  108.08,91.31 0 top
TP40  TPB1,27  [B1,27]  107.95,93.98 0 top
TP41  TPB1,27  [B1,27]  71.12,40.64 0 top
TP42  TPB1,27  [B1,27]  71.12,35.56 0 top
TP43  TPB1,27  [B1,27]  69.85,46.99 0 top
TP44  TPB1,27  [B1,27]  69.85,53.34 0 top
TP45  TPB1,27  [B1,27]  93.98,77.47 0 top
TP46  TPB1,27  [B1,27]  93.98,81.28 0 top
TP48  TPB1,27  [B1,27]  124.46,33.02 180 top
TP49  TPB1,27  [B1,27]  124.46,31.11 0 top
TP50  TPB1,27  [B1,27]  113.03,34.29 0 top
TP51  TPB1,27  [B1,27]  92.71,15.24 0 top
TP52  TPB1,27  [B1,27]  92.71,17.78 0 top
TP53  TPB1,27  [B1,27]  101.6,10.16 0 top
TP54  TPB1,27  [B1,27]  101.6,15.24 0 top
TP55  TPB1,27  [B1,27]  33.02,69.85 0 top
TP56  TPB1,27  [B1,27]  48.26,69.85 0 top
TP57  TPB1,27  [B1,27]  130.81,26.92 0 top
TP58  TPB1,27  [B1,27]  133.35,22.1 0 top
TP59  TPB1,27  [B1,27]  119.38,34.92 0 top
TP60  TPB1,27  [B1,27]  117.47,34.92 0 top
TP61  TPB1,27  [B1,27]  113.03,27.94 0 top
TP62  TPB1,27  [B1,27]  130.81,25.4 0 top
TP63  TPB1,27  [B1,27]  106.68,33.02 0 top
TVS1  SMBJ20CA-TR  [SMBJ]  8.89,55.88 0 top
U1  STM32F407VGT6  [LQFP100]  118.11,52.07 180 top
U2  TRS3232EQPWRQ1  [SOP65P640X120-16N]  81.92,12.7 270 top
U3  BTS3405G  [SOIC8]  59.05,11.43 90 top
U4  ISP452  [SOT223-W]  40.64,23.5 270 top
U5  74LVC2G17  [SOT363_INFINEON]  40.64,95.25 270 top
U6  74LVC2G17  [SOT363_INFINEON]  68.58,96.52 270 top
U7  TXB0108  [TSSOP20]  73.66,20.95 90 top
U8  BZA456A  [SOT457R_PHILIPS]  78.74,31.75 90 top
U9  USD-SOCKETNEW  [MICRO-SD-SOCKET-PP]  115.57,29.21 180 top
U10  74LVC2G17  [SOT363_INFINEON]  46.74,79.38 270 top
U11  74LVC2G17  [SOT363_INFINEON]  80.01,78.74 270 top
U12  ISP452  [SOT223-W]  40.64,12.7 270 top
U13  BTS3405G  [SOIC8]  59.05,24.13 90 top
U14  USD-SOCKETNEW  [MICRO-SD-SOCKET-PP]  100.33,96.52 0 top
U16  BZA456A  [SOT457R_PHILIPS]  45.72,110.49 90 top
U17  TXB0108  [TSSOP20]  104.78,101.6 90 top
U19  TXB0108  [TSSOP20]  114.3,86.36 180 top
U$1  OKI-78SR-5/1.5-W36-C  [OKI-78SR]  40.64,63.5 90 top
U$2  TLV2374QPWRG4Q1  [TSSOP14]  86.36,31.75 90 top
U$3  GPS_UBLOX  [GPS_UBLOX]  74.93,77.47 180 top
U$5  DEUTSCH_48_PIN  [DEUTSCH_48_PIN]  0,63.5 270 top
U$6  TLV2374QPWRG4Q1  [TSSOP14]  52.07,111.76 180 top
U$7  R1SE  [R1SE]  61.59,35.56 180 top
U$8  R1SE  [R1SE]  61.59,53.34 180 top
U$9  OKI-78SR-3.3/1.5-W36-C  [OKI-78SR]  25.4,63.5 90 top
USB1  MOLEX-47346-0001  [MOLEX-47364-0001]  154.74,109.22 180 top
USB2  MOLEX-47346-0001  [MOLEX-47364-0001]  154.74,93.98 180 top
USB3  MOLEX-47346-0001  [MOLEX-47364-0001]  154.74,30.48 180 top
VREG1  MIC5209  [SOIC8]  142.24,17.78 180 top

## Tracks (layer width: path | path; a pad name or v marks a point on that pad's centre or on a via)
5V  (via drill 0.51, 0.76)
  Top 0.178: v42.55,67.94 46.35,67.94 TP56.TP | v69.85,17.14 71.75,17.14 | C29.1 71.75,17.14 | U7.19 71.49,18.68 71.75,18.41 71.75,17.14
  Top 0.254: U$6.4 52.34,116.91 C65.2 53.72,117.22 v54.61,118.11 | R31.1 v35.56,77.47 | R32.2 v35.56,83.82 | 62.87,60.54 62.87,60.96 | C49.1 v61.59,43.18 | 87.14,31.48 v87.12,31.5 | 91.29,31.48 C74.2
  Top 0.305: U$8.P2 62.87,60.54 C52.1 | C49.1 62.87,43.18 U$7.P2
  Top 0.406: 62.87,60.96 v61.59,60.96 44.45,60.96 42.8,62.61 42.8,66.42 v42.55,66.67 | 87.14,31.48 U$2.4 91.29,31.48 91.29,32.66 v91.19,32.77
  Power 0.254: v35.56,77.47 35.56,77.6 | v35.56,83.82 35.56,84.07 | v54.61,118.11 54.23,118.11
  Bottom 0.178: v69.85,17.14 66.04,17.27
  Bottom 0.254: v61.59,43.18 61.59,43.43
  Bottom 0.406: 61.59,33.91 61.59,43.43 v61.59,60.96 | 61.59,33.91 61.59,19.05 63.5,17.14 v69.85,17.14 | 61.59,33.91 80.39,33.91 82.8,31.5 v87.12,31.5
  other vias: 38.73,67.94 40.01,67.94 41.27,67.94 38.73,66.67
  pour Top: 43.18,66.04 38.1,66.04 38.1,68.58 43.18,68.58
  pour Power (isolate 0.305): 7.62,116.84 10.16,119.38 54.61,119.38 55.88,118.11 55.88,116.84 54.61,115.57 7.62,115.57
  pour Power: 43.18,68.58 36.83,68.58 35.56,69.85 35.56,83.82 25.4,93.98 25.4,100.33 24.13,101.6 24.13,115.57 22.86,116.84 7.62,116.84 6.35,115.57 6.35,101.6 7.62,100.33 20.32,100.33 21.59,99.06 21.59,91.44 24.13,88.9 24.13,74.93 33.02,66.04 43.18,66.04
12V  (via drill 0.51)
  Top 0.254: TVS1.C 6.35,55.88
  Top 0.61: U12.4 43.74,14.53 43.94,14.73 v46.61,14.73 | U4.4 43.81,23.57 43.81,25.65 v46.61,25.65 | v20.07,55.63 20.07,58.42
  Top 1.016: C27.1 17.78,58.42 | 17.78,58.42 5.59,58.42 | U$9.P1 25.4,58.42 | 25.4,58.42 20.07,58.42 17.78,58.42 | U$1.P1 40.64,58.42 33.02,58.42 | 33.02,58.42 25.4,58.42 | C26.1 33.02,58.42
  Top 1.676: PTC1.P$2 5.59,58.42 5.59,56.64 6.35,55.88
  Bottom 0.61: v46.61,14.73 v46.61,25.65 46.61,26.54 45.59,27.56 21.97,27.56 20.07,29.46 v20.07,55.63
  pour Top: 15.24,61.59 20.32,61.59 20.32,59.69 15.24,59.69
  pour Top: 30.48,61.59 35.56,61.59 35.56,59.69 30.48,59.69
!RESET_FTDI
  Top 0.178: 146.05,79.38 R10.1 145.76,78.61 144.91,78.61 144.65,78.36 144.65,76.83 144.02,76.2 125.86,76.2 124.59,77.47 124.59,79.5 123.46,80.63 IC4.1 | 146.05,79.38 R11.2 | IC3.19 138.84,80.92 139.19,81.28 144.15,81.28 144.53,80.9 144.53,79.76 144.91,79.38 146.05,79.38
+1V8  (via drill 0.51)
  Top 0.178: v118.24,80.64 118.25,80.63 IC4.5 119.38,80.21 119.38,77.6 119.51,77.47 C30.1 | C68.2 120.36,87.5 120.4,87.5 | 120.4,87.5 120.52,87.5 | 120.52,87.5 120.65,87.38 | 120.4,87.5 120.52,87.63 | v120.65,88.9 119.89,88.9 119.51,88.52 119.51,88.14 119,87.63 116.71,87.63 | 116.71,87.63 111.12,87.63 110.74,88.01 110.74,89.28 | U19.2 116.58,87.77 116.71,87.63 | 110.74,89.28 110.74,89.41 110.24,89.92 106.05,89.92 105.79,90.17 105.79,96.52 | U19.10 110.75,89.28 110.74,89.28 | 105.79,96.52 105.79,99.31 | 105.79,96.52 C71.2 | U17.2 105.79,99.31 | U17.10 106.05,104.53 105.79,104.27 105.79,99.31 | E_1.12 128.88,97.26 128.91,97.28 | E_1.17 130.08,94.58 130.05,94.61 | 133.6,94.61 133.68,94.69 E_1.36 133.68,100.66 v140.34,107.31 | 120.52,87.5 120.65,87.5 v120.65,88.9 | v120.65,94.74 v120.65,88.9
  Bottom 0.178: v140.34,107.31 140.34,115.7 140.84,116.2 143,116.2 143.51,116.71 JP3.2 | v118.24,80.64 118.24,88.39 118.75,88.9 v120.65,88.9 | 130.05,94.61 120.78,94.61 v120.65,94.74
  Bottom 0.254: 130.05,94.61 v130.18,94.74
  other vias: 128.78,97.41 131.83,94.74 133.86,94.74
  pour Top (isolate 0.305): 128.27,97.79 129.54,97.79 129.54,95.25 134.62,95.25 134.62,93.98 128.27,93.98
  pour Bottom (isolate 0.305): 128.27,97.79 129.54,97.79 129.54,95.25 134.62,95.25 134.62,93.98 128.27,93.98
+3V3  (via drill 0.51)
  Top 0.178: L1.P$1 v135.89,61.72 | R2.1 134.62,53.47 136.4,53.47 v136.65,53.21 | 136.49,48.68 v136.53,48.64 136.27,48.39 134.62,48.39 C17.1 134.33,48.39 131.95,48.39 132.08,48.26 C11.1 | 130.63,48.57 U1.6 125.83,48.54 125.86,48.51 | 130.63,48.57 130.81,48.39 131.79,48.39 C11.1 | U1.11 130.41,51.07 130.68,50.8 130.68,48.63 130.63,48.57 | U1.19 129.75,55.07 130.68,56.01 130.68,57.02 130.94,57.28 131.79,57.28 C18.1 132.08,57.4 131.95,57.28 134.33,57.28 | 134.33,57.28 C12.1 | 134.33,57.28 v136.53,57.28 | U1.28 123.11,60.88 124.46,62.23 124.46,63.08 C1.1 124.46,63.5 124.46,65.62 C13.1 124.59,66.04 v124.59,67.94 | U1.50 112.11,61.75 111.63,62.23 110.36,62.23 | 110.36,62.23 C4.1 | v111.63,64.77 C14.1 110.36,64.48 110.36,62.23 | C66.1 C11.1 | U1.100 125.45,44.35 125.98,43.81 125.98,42.42 126.49,41.91 128.02,41.91 128.27,41.66 128.27,41.06 C7.1 | 128.02,40.81 C7.1 | v129.41,38.1 C15.1 128.14,38.39 128.14,40.64 C7.1 | U1.75 110.39,44.98 109.86,44.45 109.47,44.45 109.22,44.2 109.22,42.16 108.97,41.91 108.37,41.91 C16.1 107.95,42.04 105.7,42.04 C9.1 105.41,42.16 105.54,42.04 v103.5,42.04 | R61.2 v68.58,90.17 | R14.1 v123.19,73.66 | R15.1 v93.98,72.39 | TP5.TP 144.27,33.53 JTAG.1 v147.19,34.29 | C69.1 v109.47,83.82 109.47,82.8 109.98,82.3 116.33,82.3 116.58,82.54 U19.19 | v27.3,67.94 31.11,67.94 TP55.TP | 74.93,25.61 C28.2 v76.07,26.04 76.58,25.53 U7.10 | U14.4 94.69,109.17 v94.74,109.22 | U7.2 74.81,18.68 v74.8,18.67 | v106.17,106.43 C70.1 105.03,106.13 105.03,105.16 103.76,103.89 103.76,99.69 103.39,99.33 U17.19 | E_1.14 129.28,94.86 129.16,94.74 127.89,94.74 127.68,94.95 E_1.6 E_1.4 E_1.2 124.51,96.06 123.83,95.38 123.83,90.81
  Top 0.178: C55.1 123.83,90.81 | 123.83,90.81 v125.48,90.81 | R13.2 v97.03,67.82 | R12.2 v102.23,64.39 | U9.4 121.21,17.2 120.9,16.89 113.03,16.89 | C75.1 113.03,16.89 | 113.03,16.89 v113.03,17.78
  Top 0.254: U6.5 v70.99,96.52 | U5.5 v43.05,95.25 | U10.5 v48.77,79.38 | R33.2 v78.61,81.28 | U11.5 v81.92,78.74 | R41.2 v51.94,100.33 | R46.2 51.69,90.17 v52.07,89.79 | R58.2 v61.09,102.11 | 48.26,46.35 v48.26,48.26 | C51.1 49.02,31.75 v49.02,33.66 | U2.16 85.6,9.78 85.85,10.03 85.85,11.05 86.11,11.3 88.77,11.3 88.9,11.18 88.9,10.58 C25.1 | C25.1 v90.17,10.16 R5.1 | 88.77,10.45 C25.1 | R4.1 v87.63,20.07 | IMU.P$2 v77.47,42.93 | R36.2 78.61,74.93 v78.74,75.06 | D4.C v145.92,22.86
  Top 0.305: IC1.1 47.24,33.02 47.62,32.64 47.62,32.13 48.01,31.75 49.02,31.75 | IC2.1 47.62,46.99 48.26,46.35 C54.1
  other vias: 23.5,67.94 24.77,67.94 26.04,67.94 23.5,66.67 27.3,66.67
  pour Top: 27.94,66.04 22.86,66.04 22.86,68.58 27.94,68.58
  pour Power (isolate 0.305): 22.86,68.58 27.94,68.58 31.75,64.77 44.45,64.77 44.45,69.85 38.1,69.85 36.83,71.12 36.83,85.09 26.67,95.25 26.67,101.6 25.4,102.87 25.4,113.03 26.67,114.3 55.88,114.3 60.96,119.38 153.67,119.38 153.67,7.62 31.75,7.62 31.75,52.07 30.48,53.34 24.13,53.34 22.86,54.61
AIN1_3V3  (via drill 0.51)
  Top 0.178: 60.96,116.84 60.96,117.86 61.21,118.11 76.2,118.11 | 76.2,118.11 79.63,118.11 85.22,112.52 85.22,96.39 86.23,95.38 95.38,95.38 109.22,81.53 v114.3,81.53 | U1.15 124.57,53.07 124.46,52.96 124.46,52.58 v123.7,51.82 | v126.36,73.66 127.51,73.66 128.14,73.03 128.14,59.94 127,58.93 126.24,58.93 v125.98,59.18 | TP16.TP 76.2,118.11
  Top 0.254: R20.2 60.96,116.84 R22.2
  Bottom 0.178: 123.7,52.07 v123.7,51.82 123.83,51.69 125.73,51.69 126.36,52.32 126.36,58.8 v125.98,59.18 | v114.3,81.53 117.86,77.98 121.28,77.98 124.71,74.55 125.73,74.55 126.36,73.91 v126.36,73.66
AIN2_3V3  (via drill 0.51)
  Top 0.178: 60.96,114.3 60.96,115.32 61.21,115.57 76.2,115.57 | 76.2,115.57 81.66,115.57 84.84,112.39 84.84,96.27 86.11,95 95.25,95 109.09,81.15 113.54,81.15 v114.3,80.39 | U1.16 124.31,53.57 v123.7,52.96 | v124.84,73.66 124.84,73.41 125.35,72.9 127,72.9 127.76,72.14 127.76,60.71 127.38,60.33 v125.86,60.33 | TP17.TP 76.2,115.57
  Top 0.254: R26.2 60.96,114.3 R27.2
  Bottom 0.178: v114.3,80.39 117.22,77.47 120.9,77.47 123.19,75.18 123.32,75.18 v124.84,73.66 | v125.86,60.33 125.6,60.33 124.97,59.69 124.97,59.18 125.73,58.42 125.73,54.99 v123.7,52.96
AIN3_3V3  (via drill 0.51)
  Top 0.178: 60.96,111.76 60.96,112.78 61.21,113.03 76.2,113.03 | 76.2,113.03 83.69,113.03 84.45,112.27 84.45,96.14 85.98,94.61 95.12,94.61 108.97,80.77 113.03,80.77 113.67,80.14 113.67,78.87 113.92,78.61 v114.3,78.61 | U1.17 126.78,54.07 v127.51,53.34 | v118.24,76.33 118.62,76.33 119.25,75.69 128.02,75.69 128.91,74.8 128.91,58.17 v128.27,57.66 | TP18.TP 76.2,113.03
  Top 0.254: R28.2 60.96,111.76 R29.2
  Bottom 0.178: v114.3,78.61 114.81,78.61 114.94,78.49 114.94,78.11 115.7,77.34 115.7,76.58 116.33,75.95 117.86,75.95 v118.24,76.33 | 127.64,53.34 v127.51,53.34 128.65,53.34 128.91,53.59 128.91,54.86 128.27,55.5 v128.27,57.66
AIN4_3V3  (via drill 0.51)
  Top 0.178: 60.96,109.35 60.96,110.24 61.21,110.49 76.2,110.49 | 76.2,110.49 82.8,110.49 84.07,109.22 84.07,96.01 85.85,94.23 94.23,94.23 94.61,94.23 95,94.23 108.84,80.39 112.78,80.39 113.28,79.88 113.28,78.23 113.92,77.6 v114.3,77.6 | U1.18 127.8,54.57 v128.14,54.23 | v118.36,75.18 127.89,75.18 128.52,74.55 128.52,59.69 127.13,58.42 v127.13,57.66 | TP19.TP 76.2,110.49
  Top 0.254: R25.2 R30.2 61.34,109.22 60.96,109.35
  Bottom 0.178: v114.3,77.6 114.81,77.6 115.32,77.09 115.32,76.2 116.33,75.18 v118.36,75.18 | 128.27,54.36 v128.14,54.23 127.13,55.24 v127.13,57.66
AN_OUT1_5V
  Top 0.254: U$5.C$2 22.23,30.86 24.13,28.96 52.96,28.96 53.47,28.45 69.34,28.45 70.1,29.21 R72.2
AN_OUT2_5V
  Top 0.254: R6.2 70.36,33.02 69.85,32.51 69.85,29.84 68.96,28.96 53.72,28.96 53.21,29.46 24.38,29.46 22.73,31.11 22.73,36.7 24.51,38.48 24.51,40.39 23.11,41.78 13.97,41.78 13.34,41.15 U$5.C$4
ANALOG_IN1_5V
  Top 0.254: U$5.A$3 17.78,105.41 19.05,106.68 19.81,107.44 29.72,107.44 30.48,106.68 31.75,105.41 R21.1
ANALOG_IN2_5V
  Top 0.254: U$5.A$6 4.45,104.78 8.89,109.22 R23.1
ANALOG_IN3_5V
  Top 0.254: U$5.A$9 13.46,113.79 16.51,116.84 R24.1
ANALOG_IN4_5V
  Top 0.254: U$5.A$12 32.26,113.79 33.02,113.03 R19.1
CAN1_H
  Top 0.61: U$5.C$7 4.45,47.62 8.89,43.18 27.94,43.18 29.46,41.66 29.46,37.21 31.11,35.56 33.66,35.56 | IC1.7 33.66,35.56 | R64.2 33.66,35.56
CAN1_L
  Top 0.61: U$5.C$8 8.89,46.99 11.43,44.45 29.21,44.45 30.73,42.93 30.73,39.12 31.75,38.1 33.66,38.1 | IC1.6 33.66,38.1 | R64.1 33.66,38.1
CAN1_RX  (via drill 0.51)
  Top 0.178: IC1.2 v42.04,35.56 | v54.36,36.32 69.22,36.32 70.99,38.1 | U1.81 114.61,37.66 v115.06,37.21 | v101.6,35.69 102.49,36.58 102.49,37.08 103.89,38.48 108.97,38.48 109.86,38.48 110.49,37.85 v111.38,37.85 | v92.46,38.73 90.93,40.26 73.15,40.26 70.99,38.1 | TP42.TP 70.99,35.69 70.99,38.1
  Bottom 0.178: v115.06,37.21 113.41,37.21 112.78,37.85 v111.38,37.85 | v101.6,35.69 101.35,35.69 100.84,36.2 100.84,37.47 100.08,38.23 95.25,38.23 94.74,38.73 v92.46,38.73 | v42.04,35.56 42.04,35.81 42.55,36.32 v54.36,36.32
CAN1_TX  (via drill 0.51)
  Top 0.178: IC1.3 v41.91,38.1 | v54.36,38.48 70.74,38.48 71.12,38.86 | 71.12,38.86 73.03,40.77 91.44,40.77 v92.46,39.75 | U1.82 115.11,38.94 v115.57,38.48 | v111.38,38.99 103.63,38.99 v101.6,36.96 | 71.25,40.77 TP41.TP 71.12,38.86
  Bottom 0.178: v101.6,36.96 101.6,37.34 100.33,38.61 95.63,38.61 94.49,39.75 v92.46,39.75 | v41.91,38.1 41.91,38.23 42.16,38.48 v54.36,38.48 | v115.57,38.48 111.89,38.48 v111.38,38.99
CAN2_H
  Top 0.61: IC2.7 33.53,49.53 | 33.53,49.53 32.89,49.53 29.08,45.72 22.99,45.72 22.23,46.48 U$5.C$11 | R65.2 33.66,49.66 33.53,49.53
CAN2_L
  Top 0.61: IC2.6 35.18,52.07 33.66,52.07 | R65.1 33.66,52.07 | U$5.C$12 30.33,48.49 31.24,49.4 31.24,51.18 32.13,52.07 33.66,52.07
CAN2_RX  (via drill 0.51)
  Top 0.178: v54.36,49.53 69.85,49.53 | 69.85,49.53 71.12,49.53 71.37,49.28 71.37,43.05 73.15,41.27 91.95,41.27 v92.46,40.77 | U1.91 119.61,39.85 v119.51,39.75 | v111.38,40.13 103.38,40.13 v101.6,38.35 | TP43.TP 69.85,49.53
  Top 0.254: IC2.2 v42.04,49.53
  Bottom 0.178: v42.04,49.53 v54.36,49.53 | 92.71,40.77 v92.46,40.77 94.11,40.77 95.89,38.99 100.84,38.99 101.47,38.35 v101.6,38.35 | v119.51,39.75 111.76,39.75 v111.38,40.13
CAN2_TX  (via drill 0.51)
  Top 0.178: U1.92 120.11,40.8 v120.4,40.51 | v92.46,41.78 73.41,41.78 71.88,43.31 71.88,50.8 70.61,52.07 69.85,52.07 | v101.6,39.37 102.87,40.64 109.98,40.64 110.62,40.64 v111.38,41.4 | 69.85,52.07 v54.36,52.07 | TP44.TP 69.85,52.07
  Top 0.254: IC2.3 v41.91,52.07
  Bottom 0.178: v41.91,52.07 v54.36,52.07 | 92.71,41.78 v92.46,41.78 93.73,41.78 96.14,39.37 v101.6,39.37 | v120.4,40.51 112.27,40.51 v111.38,41.4
DAC1_3V3  (via drill 0.51)
  Top 0.178: U$2.12 84.42,30.83 87.76,34.16 v90.17,34.16 92.46,34.16 92.71,33.91 TP21.TP | U1.29 122.61,61.14 123.32,61.85 v123.32,63.75
  Bottom 0.178: v90.17,34.16 90.17,35.05 91.19,36.07 91.19,57.15 97.28,63.25 116.84,63.25 117.86,64.26 121.41,64.26 121.67,64.52 123.06,64.52 123.32,64.26 v123.32,63.75
DAC2_3V3  (via drill 0.51)
  Top 0.178: U$2.10 84.71,32.13 87.63,35.05 v91.69,35.05 92.46,35.05 92.71,35.31 TP20.TP | U1.30 122.11,63.69 v122.05,63.75
  Bottom 0.178: v91.69,35.05 91.69,56.64 97.54,62.74 116.97,62.74 117.98,63.75 v122.05,63.75
DIN1_3V3  (via drill 0.51)
  Top 0.178: R48.2 53.34,82.55 | 53.34,82.55 53.72,82.55 55.12,81.15 55.12,72.52 55.5,72.14 61.72,72.14 63.12,70.74 86.87,70.74 88.14,72.01 92.71,72.01 93.6,71.12 96.77,71.12 97.16,70.74 97.16,70.23 97.54,69.85 108.08,69.85 108.46,70.23 108.46,76.83 108.97,77.34 v109.86,77.34 | U1.38 118.11,61.59 117.09,62.61 117.09,72.14 116.08,73.15 116.08,73.66 115.57,74.17 115.57,74.8 115.19,75.18 115.19,75.56 v114.3,76.45 | TP12.TP 53.34,82.55
  Bottom 0.178: v114.3,76.45 110.74,76.45 v109.86,77.34
DIN2_3V3  (via drill 0.51)
  Top 0.178: R49.2 53.21,74.93 | 53.21,74.93 53.85,74.93 54.61,74.17 54.61,72.26 55.24,71.63 61.59,71.63 62.87,70.36 87.12,70.36 88.39,71.63 92.46,71.63 93.34,70.74 96.52,70.74 96.65,70.61 96.65,70.1 97.28,69.47 108.33,69.47 108.97,70.1 108.97,75.95 109.22,76.2 v109.86,76.2 | U1.39 117.61,61.33 116.59,62.36 116.59,72.01 115.7,72.9 115.7,73.41 115.06,74.04 115.06,74.55 v114.3,75.31 | TP13.TP 53.34,75.06 53.21,74.93
  Bottom 0.178: v114.3,75.31 110.74,75.31 v109.86,76.2
DIN3_3V3  (via drill 0.51)
  Top 0.178: U1.40 117.11,61.2 116.08,62.23 116.08,71.88 115.19,72.77 115.19,73.28 v114.3,74.17 | R50.2 85.85,81.28 86.49,81.92 86.49,82.8 87,83.31 100.33,83.31 | 100.33,83.31 103.38,83.31 108.2,78.49 111.25,78.49 111.38,78.36 111.38,74.8 111.25,74.68 v110.49,74.68 | TP14.TP 100.33,83.31
  Bottom 0.178: v114.3,74.17 111,74.17 v110.49,74.68
DIN4_3V3  (via drill 0.51)
  Top 0.178: U1.41 116.61,61.06 115.57,62.1 115.57,71.63 v114.3,72.9 | R51.2 86.11,74.93 87,75.82 87,82.55 87.38,82.93 100.33,82.93 | 100.33,82.93 103.25,82.93 108.08,78.11 110.62,78.11 110.87,77.85 110.87,75.56 110.74,75.44 109.86,75.44 109.6,75.18 109.6,73.53 109.73,73.41 v110.49,73.41 | TP15.TP 100.33,82.93
  Bottom 0.178: v114.3,72.9 111,72.9 v110.49,73.41
DIN5_3V3  (via drill 0.51)
  Top 0.178: R39.2 48.26,96.52 | 48.26,96.52 51.18,96.52 v51.69,96.01 | U1.42 116.11,60.93 115.19,61.85 115.19,70.61 v114.3,71.5 | v83.06,94.36 84.2,94.36 85.47,93.09 94.61,93.09 108.46,79.25 111.89,79.25 112.14,78.99 112.14,71.75 111.89,71.5 v111.38,71.5 | TP8.TP 48.26,96.52
  Bottom 0.178: v51.69,96.01 53.59,94.11 82.8,94.11 v83.06,94.36 | v114.3,71.5 v111.38,71.5
DIN6_3V3  (via drill 0.51)
  Top 0.178: R40.2 49.53,93.98 | 49.53,93.98 v51.69,93.98 | U1.43 115.61,60.79 114.81,61.59 114.81,69.85 114.43,70.23 v114.3,70.23 | v83.06,93.22 84.84,93.22 85.34,92.71 94.49,92.71 108.33,78.87 111.51,78.87 111.76,78.61 111.76,72.9 111.38,72.52 110.74,72.52 110.49,72.26 110.49,70.48 110.74,70.23 v111.38,70.23 | TP9.TP 49.53,93.98
  Bottom 0.178: v51.69,93.98 52.83,93.98 53.21,93.6 82.42,93.6 82.8,93.22 v83.06,93.22 | v114.3,70.23 v111.38,70.23
DIN7_3V3
  Top 0.178: R56.2 74.93,100.33 | 74.93,100.33 83.19,100.33 83.69,99.82 83.69,95.89 85.72,93.85 94.87,93.85 108.71,80.01 112.52,80.01 112.9,79.63 112.9,70.48 114.43,68.96 114.43,61.34 115.11,60.66 U1.44 | TP10.TP 74.93,100.33
DIN8_3V3
  Top 0.178: U1.45 114.61,60.52 114.05,61.09 114.05,68.71 112.52,70.23 112.52,79.38 112.27,79.63 108.58,79.63 94.74,93.47 85.6,93.47 83.57,95.5 74.93,95.5 | R57.2 73.03,92.71 73.53,93.22 73.53,94.87 74.17,95.5 74.93,95.5 | TP11.TP 74.93,95.5
DIN_STB1
  Top 0.254: 4.45,87.25 U$5.B$7 4.45,85.34 5.08,84.71 28.57,84.71 29.08,85.22 54.74,85.22 58.67,81.28 59.82,81.28 | R34.1 59.82,82.55 59.82,81.28 | 59.82,81.28 59.82,80.3 C43.1
DIN_STB2  (via drill 0.51)
  Top 0.254: 9.02,87.63 U$5.B$8 8.89,85.47 9.14,85.22 28.19,85.22 28.7,85.72 55.12,85.72 55.37,85.72 v58.55,82.55 | v58.42,73.66 59.82,73.66 | C44.1 59.82,73.66 | 59.82,73.66 59.82,75.91 R37.1
  Bottom 0.254: v58.55,82.55 v58.42,73.66
DIN_STB3
  Top 0.254: U$5.B$9 13.34,89.66 13.34,89.92 16,92.58 30.48,92.58 34.42,96.52 34.42,98.77 | 34.42,98.77 C45.1 | C45.1 34.42,99.06 34.29,99.19 | R42.1 34.54,101.47 34.42,101.35 34.42,99.35 C45.1 | 34.42,98.77 C45.1
DIN_STB4
  Top 0.254: U$5.B$10 17.78,89.41 19.81,91.44 R47.1 34.67,91.44 34.42,91.19 34.42,89.19 C46.1 34.42,88.9 34.29,89.03
DIN_STB5  (via drill 0.51)
  Top 0.254: U$5.B$11 22.23,88.77 23.5,90.04 v25.15,90.04 | v50.8,97.79 53.47,97.79 | C47.1 53.47,97.79 | 53.47,97.79 53.47,100.04 R59.1
  Bottom 0.254: v25.15,90.04 29.72,90.04 37.47,97.79 v50.8,97.79
DIN_STB6  (via drill 0.51)
  Top 0.254: R62.1 53.47,93.69 53.47,91.44 C48.1 v51.94,91.44 | U$5.B$12 29.59,87.63 v32.26,90.3
  Bottom 0.254: v32.26,90.3 34.8,92.84 50.55,92.84 v51.94,91.44
DIN_STG1
  Top 0.254: 38.23,80.01 37.34,80.01 36.92,80.43 R32.1 35.52,80.39 28.96,80.39 28.07,81.28 22.86,81.28 22.23,80.64 U$5.B$2 | C42.1 38.23,80.01 | 38.23,80.01 38.23,82.26 R45.1
DIN_STG2
  Top 0.254: U$5.B$4 13.34,75.82 14.99,74.17 33.53,74.17 33.91,73.79 35.27,73.79 R31.2 35.56,73.79 37.08,73.79 37.34,73.53 38.39,73.53 C41.1 38.23,73.66 38.23,75.91 R44.1
DOUT_HS1_3V3  (via drill 0.51)
  Top 0.178: U1.61 109.33,53.07 108.71,52.45 107.57,52.45 106.81,51.69 95.76,51.69 95.38,51.31 95.38,31.75 v97.92,29.21 | TP28.TP 101.09,27.43 v97.92,27.43 92.46,27.43 90.55,25.53 90.04,25.53 86.36,21.84 80.14,21.84 79.63,21.84 77.72,21.84 77.16,21.28 U7.6
  Bottom 0.178: v97.92,29.21 v97.92,27.43
DOUT_HS1_5V  (via drill 0.51)
  Top 0.178: 52.07,19.02 51.02,19.02 50.29,18.29 v50.29,16.64 | R52.1 49.53,10.16 50.29,10.92 v50.29,14.22 | TP23.TP 52.07,19.02 | 52.07,19.02 67.28,19.02 v67.31,19.05 | U7.15 69.54,21.28 v69.47,21.21
  Bottom 0.178: v50.29,16.64 v50.29,14.22 | v67.31,19.05 v69.47,21.21
DOUT_HS1_12V
  Top 0.61: U12.1 34.29,15.4 | C62.1 34.29,15.4 | U$5.D$11 22.23,21.72 24.89,19.05 29.72,19.05 33.4,15.37 34.26,15.37 34.29,15.4
DOUT_HS2_3V3
  Top 0.178: U1.62 109.34,52.57 108.84,52.07 107.7,52.07 106.93,51.31 96.01,51.31 95.76,51.05 95.76,32.64 98.81,29.59 | 98.81,29.59 98.81,28.96 98.3,28.45 92.96,28.45 90.42,25.91 89.92,25.91 86.23,22.23 80.01,22.23 77.47,22.23 77.17,21.93 U7.7 | TP29.TP 101.6,30.23 100.97,29.59 98.81,29.59
DOUT_HS2_5V  (via drill 0.51)
  Top 0.178: TP22.TP 48.39,17.78 48.9,18.29 48.9,20.54 R18.1 49.78,20.95 51.32,19.41 65.77,19.41 66.15,19.41 v66.42,19.68 | U7.14 69.76,21.93 v69.22,22.48
  Bottom 0.178: v69.22,22.48 v66.42,19.68
DOUT_HS2_12V
  Top 0.61: U4.1 34.92,26.2 | 34.92,26.2 27.46,26.2 26.67,25.4 U$5.D$12 | C40.1 34.92,26.2
DOUT_LS1  (via drill 0.51)
  Top 0.254: C35.1 54.48,10.16 54.61,10.03
  Top 0.305: 56.45,10.16 U3.8 56.39,9.46 56.39,8.64 56.26,8.51 54.61,8.51 54.61,10.03 | 56.45,10.16 U3.7 | 56.45,10.16 58.55,10.16 58.8,10.41 58.8,14.48 58.42,14.86 54.23,14.86 53.34,15.75 48.26,15.75 47.62,16.38 46.48,16.38 45.34,17.53 34.67,17.53 v34.29,17.91
  Bottom 0.305: U$5.D$7 4.45,20.95 7.49,17.91 v34.29,17.91
DOUT_LS1_3V3  (via drill 0.51)
  Top 0.178: U1.57 108.92,55.07 108.84,54.99 108.84,54.61 108.2,53.98 107.06,53.98 106.3,53.21 94.87,53.21 93.85,52.2 v93.85,29.21 | TP31.TP 95.38,24 v93.85,24 90.55,24 86.87,20.32 80.64,20.32 80.52,20.32 79.5,20.32 78.99,20.32 77.85,19.18 77.85,18.67 77.21,18.03 U7.1
  Bottom 0.178: v93.85,24 v93.85,29.21
DOUT_LS1_5V
  Top 0.178: 69.47,10.79 70.48,11.81 70.48,15.88 70.23,16.13 70.1,16.26 69.47,16.26 68.96,16.76 68.96,17.78 69.22,18.03 U7.20 | 69.47,10.79 R16.1 | TP24.TP 70.1,10.16 69.47,10.79 | U7.20
DOUT_LS2  (via drill 0.51)
  Top 0.254: C2.1 54.36,12.7 54.48,12.83
  Top 0.305: U3.6 U3.5 56.45,14.03 56.26,14.22 54.48,14.22 | 54.48,12.83 54.48,14.22 | 54.48,14.22 53.85,14.22 52.96,15.11 47.88,15.11 47.37,15.62 46.1,15.62 44.96,16.76 33.53,16.76 32.77,17.53 v32.77,22.23
  Bottom 0.305: v32.77,22.23 29.59,22.23 29.08,21.72 29.08,21.08 26.92,18.92 11.18,18.92 8.89,21.21 U$5.D$8
DOUT_LS2_3V3  (via drill 0.51)
  Top 0.178: U1.58 109.31,54.57 108.33,53.59 107.19,53.59 106.43,52.83 95,52.83 94.23,52.07 94.23,29.97 94.87,29.34 v94.87,29.21 | TP33.TP 97.16,24.77 v94.87,24.77 91.44,24.77 91.06,24.38 90.42,24.38 86.74,20.7 80.52,20.7 79.5,20.7 78.74,20.7 78.23,20.19 77.37,19.33 U7.3
  Bottom 0.178: v94.87,24.77 v94.87,29.21
DOUT_LS2_5V
  Top 0.178: 67.82,13.63 R17.1 68.2,13.34 68.45,13.59 68.45,15.24 | 68.45,15.24 68.45,18.16 68.97,18.68 69.62,19.33 U7.18 | TP25.TP 68.45,15.24
DOUT_LS3
  Top 0.254: C63.1 54.61,22.86 | 54.61,21.46 54.74,21.34
  Top 0.305: U13.8 U13.7 56.45,21.66 56.13,21.34 54.74,21.34 50.42,21.34 49.78,21.97 49.78,25.78 48.01,27.56 25.78,27.56 24.77,26.54 24.77,25.15 24.13,24.51 21.21,24.51 19.81,23.11 19.81,20.95 18.8,19.94 15.72,19.94 U$5.D$9 | 54.61,22.86 54.61,21.46
DOUT_LS3_3V3  (via drill 0.51)
  Top 0.178: U1.59 109.31,54.07 108.46,53.21 107.31,53.21 106.55,52.45 95.25,52.45 94.61,51.82 94.61,30.48 v95.89,29.21 | TP32.TP 98.81,25.65 v95.89,25.65 91.82,25.65 90.93,24.77 90.3,24.77 86.61,21.08 80.39,21.08 79.12,21.08 78.49,21.08 77.85,20.45 77.38,19.98 U7.4
  Bottom 0.178: v95.89,25.65 v95.89,29.21
DOUT_LS3_5V
  Top 0.178: TP26.TP 67.82,20.45 | U7.17 68.28,19.98 67.82,20.45 | 67.82,20.45 67.82,22.57 R53.1
DOUT_LS4
  Top 0.254: C64.1 54.48,25.4 54.61,25.53
  Top 0.305: U13.6 U13.5 56.45,26.73 56.26,26.92 54.74,26.92 | 54.74,26.92 54.1,26.92 52.7,28.32 25.15,28.32 22.23,25.4 20.95,25.4 17.88,22.33 U$5.D$10 | 54.61,25.53 54.61,26.8 54.74,26.92
DOUT_LS4_3V3  (via drill 0.51)
  Top 0.178: U1.60 109.32,53.57 108.58,52.83 107.44,52.83 106.68,52.07 95.5,52.07 95,51.56 95,31.11 v96.9,29.21 | TP30.TP 100.46,26.54 v96.9,26.54 92.08,26.54 90.68,25.15 90.17,25.15 86.49,21.46 80.26,21.46 78.74,21.46 78.23,21.46 77.98,21.46 77.72,21.21 77.14,20.63 U7.5
  Bottom 0.178: v96.9,26.54 v96.9,29.21
DOUT_LS4_5V
  Top 0.178: TP27.TP 67.56,27.43 67.94,27.05 67.94,25.82 R54.1 68.2,25.4 68.45,25.15 68.45,21.21 68.45,20.95 68.96,20.45 69.85,20.45 70.03,20.63 U7.16
FTDI_DN  (via drill 0.51)
  Top 0.178: USB2.2 146.92,93.33 138.81,85.22 v138.81,84.71 | IC3.16 138.19,78.97 v138.81,78.36
  Bottom 0.178: v138.81,78.36 v138.81,84.71
FTDI_DP  (via drill 0.51)
  Top 0.178: USB2.3 146.69,93.98 v137.54,84.84 | v137.54,77.72 137.54,77.98 137.16,78.36 135.74,78.36 IC3.15
  Bottom 0.178: v137.54,84.84 v137.54,77.72
FTDI_RX
  Top 0.178: IC3.5 131.55,84.17 132.08,84.71 132.08,88.9 | 132.08,88.9 E_1.27 | TP36.TP 132.08,88.9
FTDI_TX  (via drill 0.51)
  Top 0.178: IC4.4 119.8,82.46 120.02,82.68 120.78,82.68 122.05,83.95 | E_1.22 130.88,106.5 v131.7,107.31 | TP37.TP 122.05,83.95 | v128.91,107.31 128.91,104.9 128.52,104.52 122.3,104.52 v122.05,104.27 | v122.05,95.63 122.05,83.95
  Bottom 0.178: v122.05,95.63 v122.05,104.27 | v131.7,107.31 v128.91,107.31
FTDI_VBUS
  Top 0.178: USB2.1 147.67,92.68 146.05,91.06 FB9.1
FTDI_VCC
  Top 0.178: R10.2 146.47,76.2 147.45,76.2 147.96,76.71 147.96,81.15 148.84,82.04 154.18,82.04 154.69,82.55 154.69,83.69 154.56,83.82 D2.A 154.69,84.09 154.69,85.22 153.54,86.36 146.05,86.36 FB9.2 145.63,86.36 141.35,86.36 140.12,85.13 C57.1 139.32,82.55 138.34,81.58 137.92,81.58 | IC3.20 137.92,81.58 | TP35.TP 137.92,82.8 137.92,81.58
FW_RCVR  (via drill 0.51)
  Top 0.178: E_1.69 141.04,93.42 141.35,93.73 141.35,101.98 145.29,105.92 v145.29,107.31
  Bottom 0.178: JP3.4 148.59,117.22 145.29,113.92 v145.29,107.31
G_CAN1
  Top 0.305: C32.1 48.9,38.1 | 48.9,38.1 52.28,38.1 C50.2 52.7,40.01 53.36,40.66 U$7.P4 | 48.9,38.1 48.9,40.64 46.99,42.55 37.47,42.55 36.83,41.91 IC1.5
G_CAN2
  Top 0.305: C33.1 48.9,52.07 | 48.9,52.07 52.28,52.07 C53.2 52.7,57.78 53.36,58.44 U$8.P4 | 48.9,52.07 48.9,55.88 48.26,56.52 37.47,56.52 36.83,55.88 IC2.5
GND  (via drill 0.51, 0.76)
  Top 0.178: U14.GND3 101.31,110.07 v101.35,110.11 | U14.GND1 88.19,111.07 v88.39,110.87 | U14.6 96.89,109.34 v96.9,109.35 | USB1.GND2 153.22,106.72 | USB1.5 148.94,110.52 v147.96,111.51 | USB2.GND2 153.22,91.48 | USB2.5 148.62,95.28 v148.59,95.25 | R9.1 v146.05,83.82 R11.1 | C57.2 v143.64,82.55 | v143.51,80.01 C56.2 | IC3.21 133.41,82.22 v132.84,81.66 | IC3.18 133.34,80.28 132.84,80.77 v132.84,81.66 | IC3.7 131.63,82.88 v132.84,81.66 | v132.97,85.47 IC3.26 IC3.25 | IC4.3 122.57,81.93 v123.19,82.55 | C5.1 v138.43,58.29 | C3.2 134.15,68.16 v134.11,68.2 134.07,68.16 C6.2 | C8.2 132.08,53.47 v130.05,53.47 | C11.2 C17.2 136.36,50.38 v136.53,50.55 | C10.1 v138.43,45.72 | U1.10 129.39,50.57 v129.79,50.16 | U1.20 129.61,55.57 130.3,56.26 130.3,59.18 130.68,59.56 131.79,59.56 | 131.79,59.56 C18.2 132.08,59.44 131.95,59.56 | 134.33,59.56 v136.53,59.56 | 131.79,59.56 134.33,59.56 | 134.33,59.56 C12.2 | U1.27 123.61,60.62 124.08,61.09 126.11,61.09 126.87,61.85 126.87,63.21 C1.2 126.87,63.5 126.87,65.75 C13.2 126.87,66.04 v126.87,68.07 | C14.2 v106.43,64.77 | C19.2 108.08,67.31 107.95,67.18 107.95,65.19 C14.2 | C14.2 108.2,64.77 108.08,64.64 108.08,62.52 C4.2 | C66.2 132.08,44.7 132.21,44.58 v134.11,44.58 | U1.99 123.61,43.65 123.83,43.43 125.09,43.43 125.48,43.05 125.48,42.16 125.86,41.78 125.86,40.93 C7.2 125.73,40.22 125.73,38.23 125.86,38.1 C15.2 v124.46,38.1 | R3.2 v129.54,35.56 | U1.74 109.82,46.57 109.47,46.23 109.47,45.09 109.22,44.83 108.08,44.83 107.95,44.7 C16.2 107.66,44.32 105.41,44.32 105.41,44.2 | 103.54,44.03 v103.5,44.07 103.63,44.2 105.41,44.2 | C9.2 105.41,44.2 | C20.2 v101.6,40.77 | TG7.TP JTAG.3 JTAG.5 JTAG.7 JTAG.9 144.4,39.37 v144.4,41.78
  Top 0.178: C68.1 v120.65,83.82 | v109.47,88.77 C69.2 109.77,87.5 | C29.2 v71.75,11.3 | C30.2 v123.19,77.47 | TG6.TP v133.86,72.39 | TG3.TP v77.72,105.41 | TG4.TP v49.66,64.77 | TG2.TP 107.95,10.16 v108.08,10.03 | TG5.TP 104.27,74.93 v104.39,74.8 | C28.1 72.26,26.04 | 72.26,26.04 v71.5,26.04 70.74,25.28 U7.11 | 72.39,25.91 72.26,26.04 | U19.11 v111.38,85.09 | USB3.5 149.76,31.78 v149.73,31.75 | U17.11 v101.86,106.42 v101.85,106.43 C70.2 | C71.1 v101.73,96.52 | E_1.5 127.68,92.25 v127.64,92.2 | E_1.1 126.88,92.32 127,92.2 v127.64,92.2 | E_1.11 128.88,92.3 128.78,92.2 v127.64,92.2 | E_1.9 E_1.11 | E_1.15 E_1.13 E_1.11 | C55.2 v123.83,87 | C75.2 113.03,14.1 113.16,13.97 v114.81,13.97 116.02,15.18 U9.GND3 | U9.6 v119.01,19.8 v119,19.81 | U9.GND1 129.17,12.58 v129.16,12.57
  Top 0.254: U13.3 v63.5,24.77 | v63.5,22.23 U13.1 | C64.2 v50.8,25.4 | v50.8,22.86 C63.2 | 52.49,14.19 v52.45,14.22 52.07,13.84 52.07,12.7 C2.2 | 52.49,8.47 v52.58,8.38 52.07,8.89 52.07,10.16 C35.2 | U3.3 v63.5,12.06 | v63.5,9.53 U3.1 | 77.47,12.32 v75.31,12.32 | C38.1 v41.91,116.84 | v41.91,113.03 C39.1 | U$6.11 52.34,107.2 v52.32,107.19 | C37.1 v41.91,109.22 | C36.1 v41.91,105.41 | U16.5 v43.18,110.49 | v48.13,110.49 U16.2 | C65.1 v48.26,117.22 | R22.1 v64.9,116.84 | v64.77,114.3 R27.1 | R29.1 v64.77,111.76 | v64.77,109.22 R30.1 | R8.1 v90.17,36.83 | R70.1 v90.04,26.67 91.44,28.07 v91.44,28.19 | U$2.11 81.68,31.48 v81.66,31.5 81.41,31.75 U8.2 | C61.1 80.61,37.68 v80.64,37.72 | C67.1 80.22,25.82 v80.52,25.53 | C45.2 v37.97,99.06 | C46.2 v37.97,88.9 | U5.2 38.1,95.25 v37.59,94.74 | C47.2 v57.28,97.79 | U6.2 v66.29,96.52 | C48.2 v57.02,91.44 | C59.2 42.33,84.29 v42.29,84.33 | C42.2 v41.78,80.01 | U10.2 v44.45,79.38 | C41.2 v41.91,73.66 | C58.2 v45.59,76.2 | C43.2 v63.63,80.01 | U11.2 v77.85,78.74 | C44.2 v63.37,73.66 | C25.2 86.61,10.16 86.36,9.91 v86.36,8.26 83.95,8.26 83.54,8.66 U2.15 | IMU.P$14 v74.93,61.09 | IMU.P$7 v90.17,43.18 | IMU.P$1 v74.93,43.05 | B1.- v148.59,67.31 TG1.TP | R43.1 40.22,100.24 v40.64,99.82 41.08,99.38 T3.E | R55.1 40.22,89.95 v40.51,89.66 40.95,89.22 T4.E | R35.1 65.62,81.06 v65.91,80.77 66.36,80.33 T1.E | R38.1 65.62,74.59 v65.91,74.3 66.23,73.98 T2.E | R63.1 59.27,93 v59.82,92.46 60.39,93.03 T6.E | R60.1 59.27,97.45 v59.82,96.9 59.88,96.84 T5.E | USB1.GND4 154.74,111.94 154.56,111.76 152.48,111.76 USB1.GND3 152.44,112.99 v151.13,114.3 | USB1.GND1 154.74,106.38 154.43,106.68 152.48,106.68 | 152.48,106.68 USB1.GND2 | 152.48,106.68 152.48,105.61 v151,104.14
  Top 0.254: USB2.GND4 154.74,96.7 154.56,96.52 152.48,96.52 USB2.GND3 152.44,97.63 v151,99.06 | USB2.GND1 154.74,91.39 154.56,91.57 152.52,91.57 USB2.GND2 152.44,90.33 v151.13,89.03 | USB3.GND1 154.74,27.76 154.56,27.94 154.56,27.81 152.6,27.81 USB3.GND2 152.44,25.06 v152.27,24.89 | USB3.GND4 154.74,33.33 154.43,33.02 152.48,33.02 USB3.GND3 152.44,34.89 v151.76,35.56 | C73.- | C73.- 147.32,15.49 | C73.- v147.32,13.84 | VREG1.8 v144.15,13.34 | VREG1.7 v142.88,13.34 | VREG1.6 v141.6,13.34 | VREG1.5 v140.34,13.34 | C60.- 137.16,15.49 | 137.16,15.49 v137.16,14.22 | C34.2 133.35,15.88 133.73,15.49 137.16,15.49 | C31.2 v134.62,22.86 | U8.5 v76.33,31.75 | C73.- 147.32,15.62 147.45,15.49 149.99,15.49 150.37,15.88 C72.2
  Top 0.305: IC2.4 v42.55,54.61 | U$7.P1 65.41,43.18 C49.2 v67.31,43.18 | C51.2 51.44,31.75 v51.44,33.66 | C54.2 51.44,46.35 v51.44,48.26 | C21.1 77.47,12.32 C22.1 | IC1.4 v43.18,40.64 | v40.01,23.5 U4.2 35.34,23.5 C40.2 | v40.01,12.7 U12.2 34.29,12.7 C62.2 | C52.2 65.53,60.96 65.41,60.83 U$8.P1
  Top 0.406: 65.53,60.96 v66.8,60.96 | C74.1 v91.44,28.19
  Top 0.61: TVS1.A v13.97,55.88 | C27.2 v17.78,67.31 | C26.2 v33.02,67.31
  pour Ground (isolate 0.305): 2.54,7.62 2.54,119.38 153.67,119.38 153.67,7.62
  pour Top: 20.32,65.41 15.24,65.41 15.24,67.31 20.32,67.31
  pour Top: 35.56,65.41 30.48,65.41 30.48,67.31 35.56,67.31
GP12  (via drill 0.51)
  Top 0.178: E_1.35 133.68,91.87 v135.25,90.3 | 119.89,105.28 v119.76,105.28 119.76,105.79 120.14,106.17 125.86,106.17 126.75,105.28 v127.76,105.28